# EAGLE design layer3 (EAGLE 9.6.2)

## Sheet 1 of 5
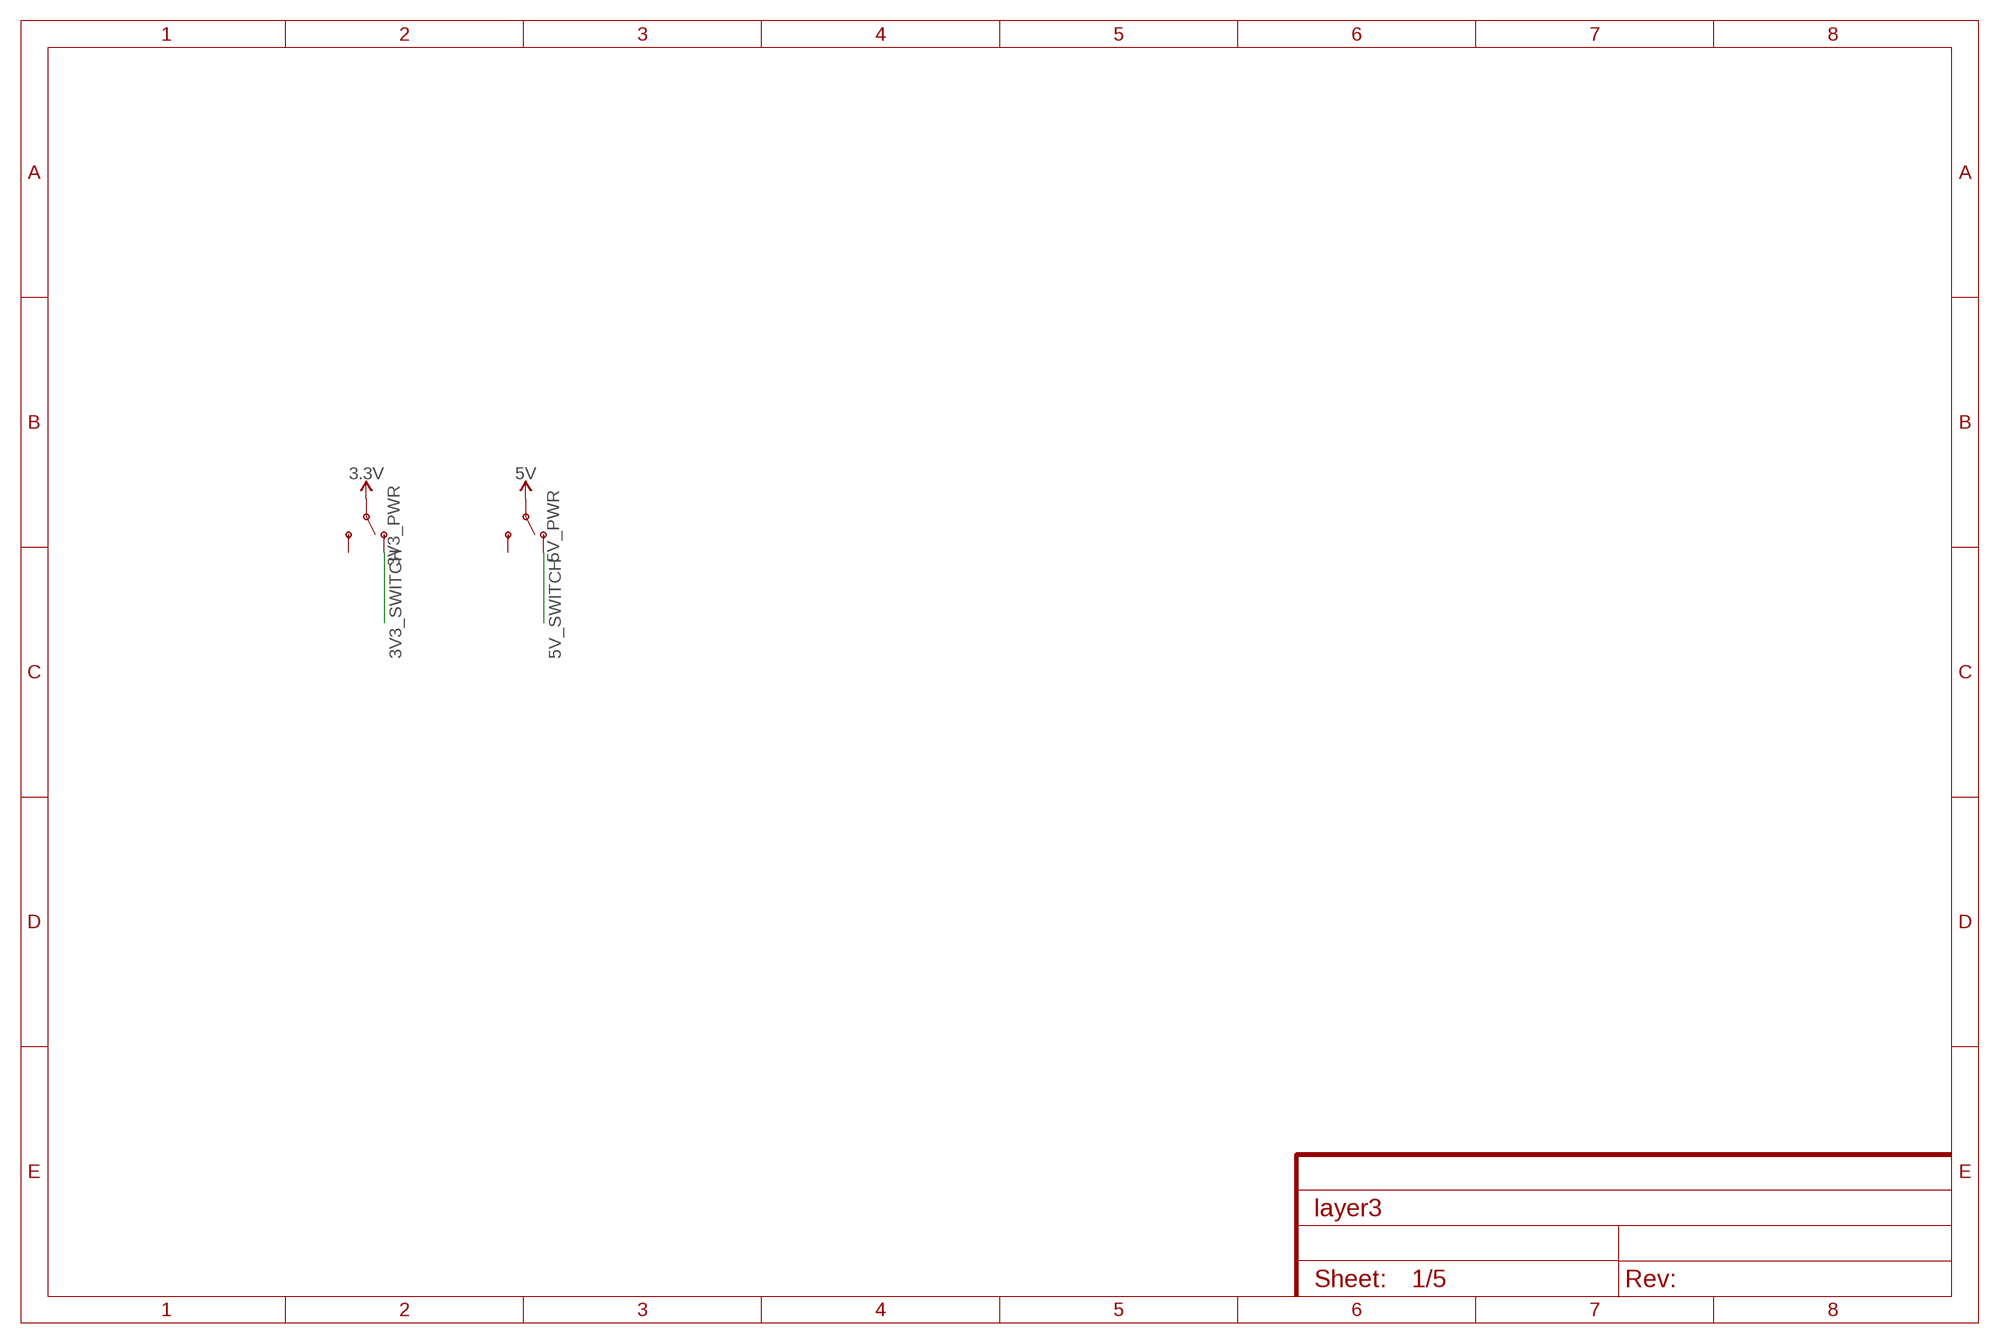
[diagram p0: schematic, sheet 1]

### Parts
3V3_PWR  SWITCH-SPDT-PTH-11.6X4.0MM-LOCK  [SWITCH_SPDT_PTH_11.6X4.0MM_LOCK]
5V_PWR  SWITCH-SPDT-PTH-11.6X4.0MM-LOCK  [SWITCH_SPDT_PTH_11.6X4.0MM_LOCK]

### Nets
3.3V: 3V3_PWR.2(P) ; also sheet 4,5
3V3_SWITCH: 3V3_PWR.1(O) ; also sheet 2,3,4
5V: 5V_PWR.2(P) ; also sheet 5
5V_SWITCH: 5V_PWR.1(O) ; also sheet 4
Unconnected: 3V3_PWR.3(S) 5V_PWR.3(S)

## Sheet 2 of 5: STEM32
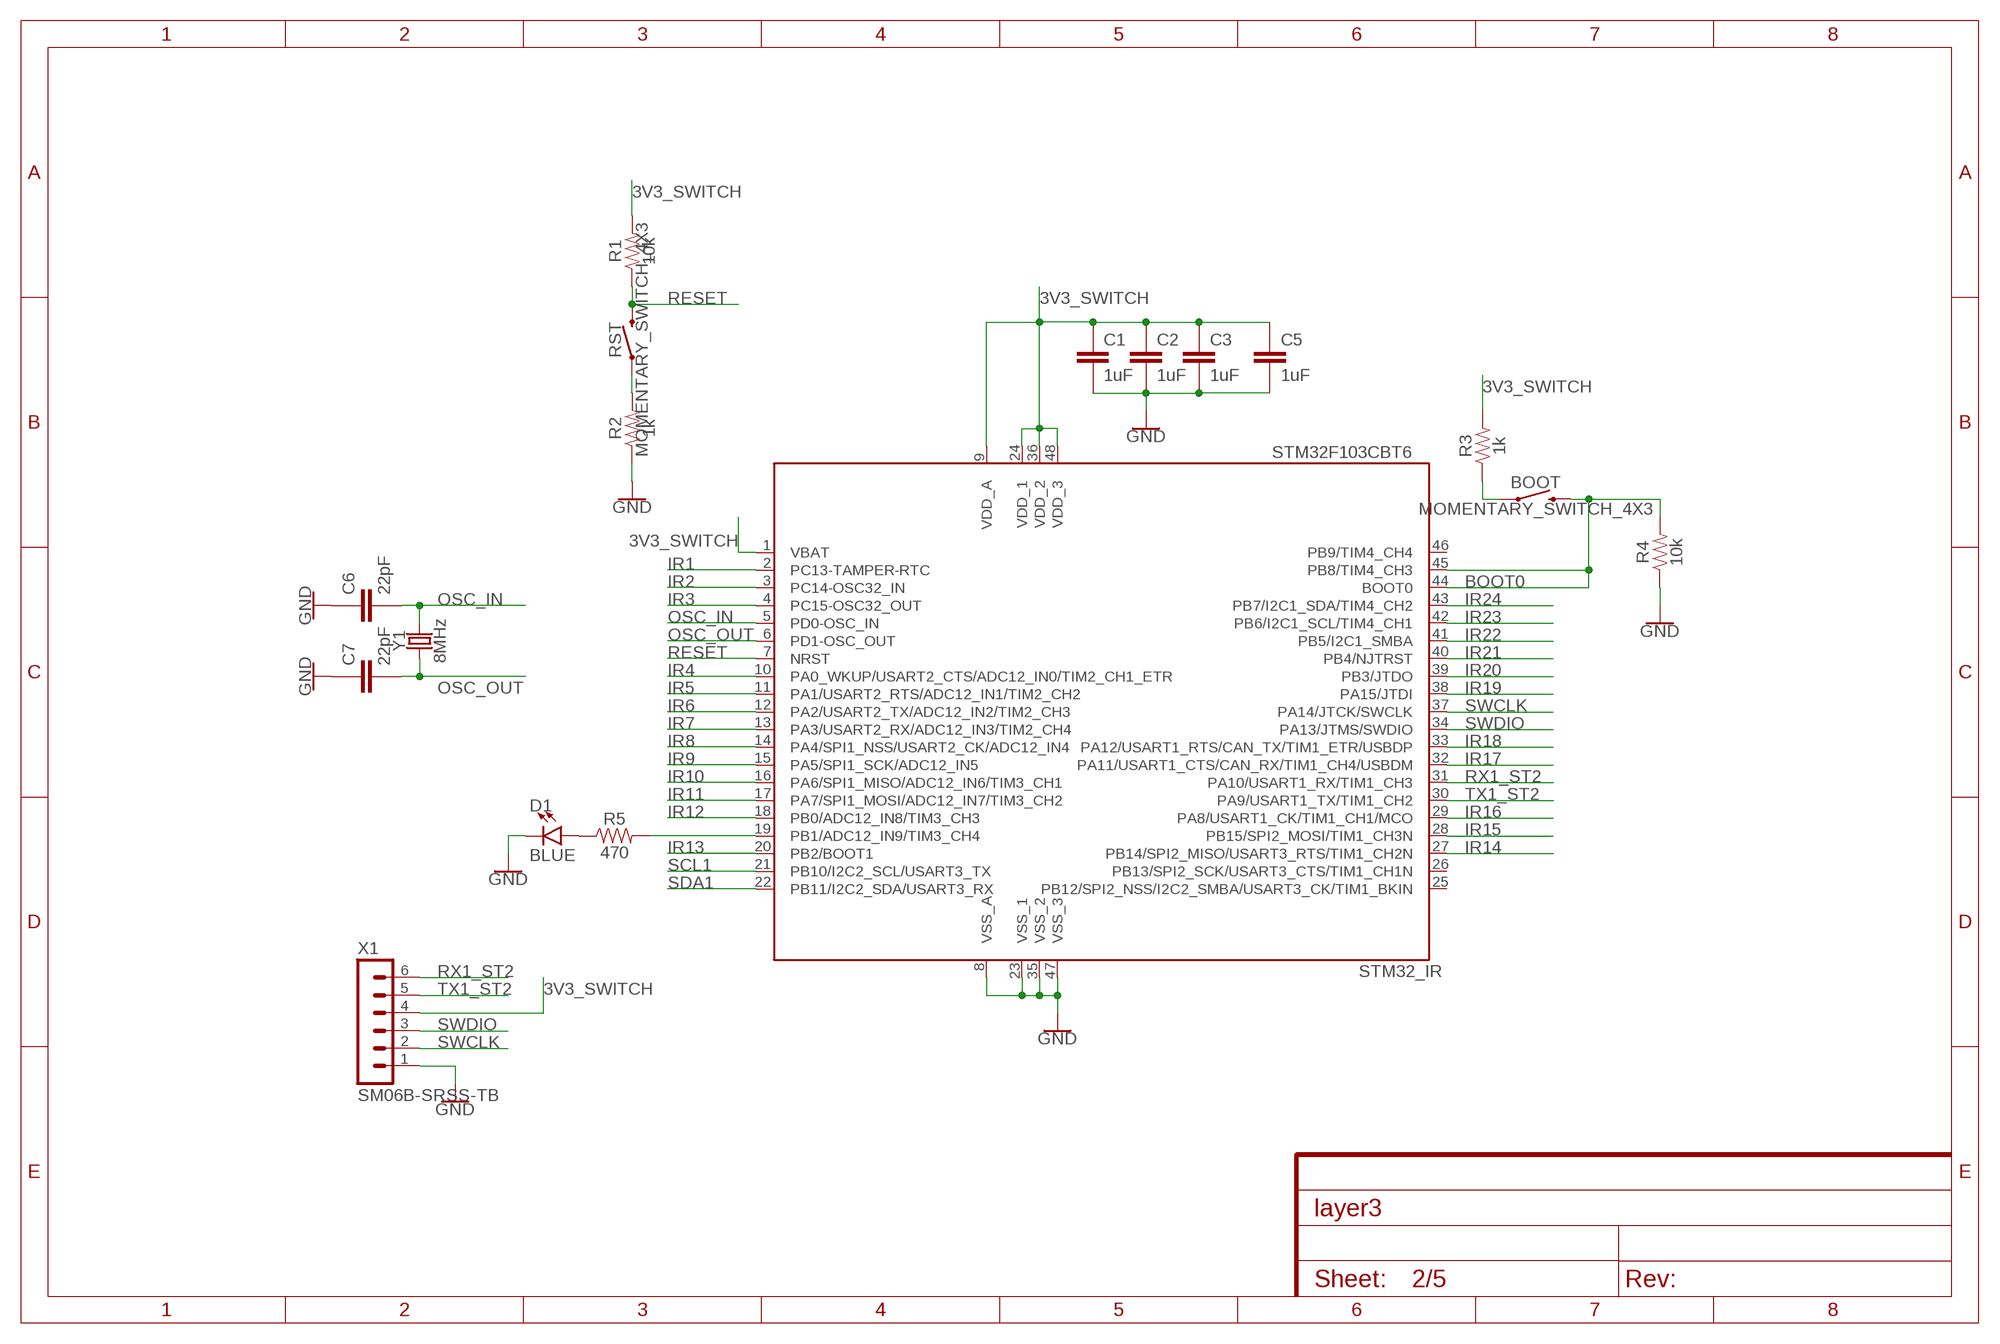
[diagram p1: schematic, sheet 2]

### Parts
BOOT  MOMENTARY_SWITCH_4X3  [MOMENTARY_SWITCH_4X3]
C1  1uF  CAPACITOR0603  [C0603]
C2  1uF  CAPACITOR0603  [C0603]
C3  1uF  CAPACITOR0603  [C0603]
C5  1uF  CAPACITOR0603  [C0603]
C6  22pF  CAPACITOR0603  [C0603]
C7  22pF  CAPACITOR0603  [C0603]
D1  BLUE  LED0603  [LED-0603]
R1  10k  RESISTOR0603  [R0603]
R2  1k  RESISTOR0603  [R0603]
R3  1k  RESISTOR0603  [R0603]
R4  10k  RESISTOR0603  [R0603]
R5  470  RESISTOR0603  [R0603]
RST  MOMENTARY_SWITCH_4X3  [MOMENTARY_SWITCH_4X3]
STM32_IR  STM32F103CBT6  [LQFP48]
X1  SM06B-SRSS-TB  [SM06B-SRSS-TB]
Y1  8MHz  CRYSTALSMD-5X3.2-2PAD  [CRYSTAL-SMD-5X3.2-2PAD]

### Nets
3V3_SWITCH: C1.1 C2.1 C3.1 C5.2 R1.2 R3.2 STM32_IR.1(VBAT) STM32_IR.9(VDD_A) STM32_IR.24(VDD_1) STM32_IR.36(VDD_2) STM32_IR.48(VDD_3) X1.4 ; also sheet 1,3,4
BOOT0: BOOT.P$2 R4.2 STM32_IR.44(BOOT0) STM32_IR.45(PB8/TIM4_CH3)
GND: C1.2 C2.2 C3.2 C5.1 C6.1 C7.1 D1.C R2.1 R4.1 STM32_IR.8(VSS_A) STM32_IR.23(VSS_1) STM32_IR.35(VSS_2) STM32_IR.47(VSS_3) X1.1 ; also sheet 3,4,5
IR1: STM32_IR.2(PC13-TAMPER-RTC) ; also sheet 3
IR2: STM32_IR.3(PC14-OSC32_IN) ; also sheet 3
IR3: STM32_IR.4(PC15-OSC32_OUT) ; also sheet 3
IR4: STM32_IR.10(PA0_WKUP/USART2_CTS/ADC12_IN0/TIM2_CH1_ETR) ; also sheet 3
IR5: STM32_IR.11(PA1/USART2_RTS/ADC12_IN1/TIM2_CH2) ; also sheet 3
IR6: STM32_IR.12(PA2/USART2_TX/ADC12_IN2/TIM2_CH3) ; also sheet 3
IR7: STM32_IR.13(PA3/USART2_RX/ADC12_IN3/TIM2_CH4) ; also sheet 3
IR8: STM32_IR.14(PA4/SPI1_NSS/USART2_CK/ADC12_IN4) ; also sheet 3
IR9: STM32_IR.15(PA5/SPI1_SCK/ADC12_IN5) ; also sheet 3
IR10: STM32_IR.16(PA6/SPI1_MISO/ADC12_IN6/TIM3_CH1) ; also sheet 3
IR11: STM32_IR.17(PA7/SPI1_MOSI/ADC12_IN7/TIM3_CH2) ; also sheet 3
IR12: STM32_IR.18(PB0/ADC12_IN8/TIM3_CH3) ; also sheet 3
IR13: STM32_IR.20(PB2/BOOT1) ; also sheet 3
IR14: STM32_IR.27(PB14/SPI2_MISO/USART3_RTS/TIM1_CH2N) ; also sheet 3
IR15: STM32_IR.28(PB15/SPI2_MOSI/TIM1_CH3N) ; also sheet 3
IR16: STM32_IR.29(PA8/USART1_CK/TIM1_CH1/MCO) ; also sheet 3
IR17: STM32_IR.32(PA11/USART1_CTS/CAN_RX/TIM1_CH4/USBDM) ; also sheet 3
IR18: STM32_IR.33(PA12/USART1_RTS/CAN_TX/TIM1_ETR/USBDP) ; also sheet 3
IR19: STM32_IR.38(PA15/JTDI) ; also sheet 3
IR20: STM32_IR.39(PB3/JTDO) ; also sheet 3
IR21: STM32_IR.40(PB4/NJTRST) ; also sheet 3
IR22: STM32_IR.41(PB5/I2C1_SMBA) ; also sheet 3
IR23: STM32_IR.42(PB6/I2C1_SCL/TIM4_CH1) ; also sheet 3
IR24: STM32_IR.43(PB7/I2C1_SDA/TIM4_CH2) ; also sheet 3
N$70: R2.2 RST.P$1
N$72: BOOT.P$1 R3.1
N$73: R5.2 STM32_IR.19(PB1/ADC12_IN9/TIM3_CH4)
N$74: D1.A R5.1
OSC_IN: C6.2 STM32_IR.5(PD0-OSC_IN) Y1.P$2
OSC_OUT: C7.2 STM32_IR.6(PD1-OSC_OUT) Y1.P$1
RESET: R1.1 RST.P$2 STM32_IR.7(NRST)
RX1_ST2: STM32_IR.31(PA10/USART1_RX/TIM1_CH3) X1.6 ; also sheet 4
SCL1: STM32_IR.21(PB10/I2C2_SCL/USART3_TX)
SDA1: STM32_IR.22(PB11/I2C2_SDA/USART3_RX)
SWCLK: STM32_IR.37(PA14/JTCK/SWCLK) X1.2
SWDIO: STM32_IR.34(PA13/JTMS/SWDIO) X1.3
TX1_ST2: STM32_IR.30(PA9/USART1_TX/TIM1_CH2) X1.5 ; also sheet 4
Unconnected: STM32_IR.25(PB12/SPI2_NSS/I2C2_SMBA/USART3_CK/TIM1_BKIN) STM32_IR.26(PB13/SPI2_SCK/USART3_CTS/TIM1_CH1N) STM32_IR.46(PB9/TIM4_CH4)

## Sheet 3 of 5: IR Sensor
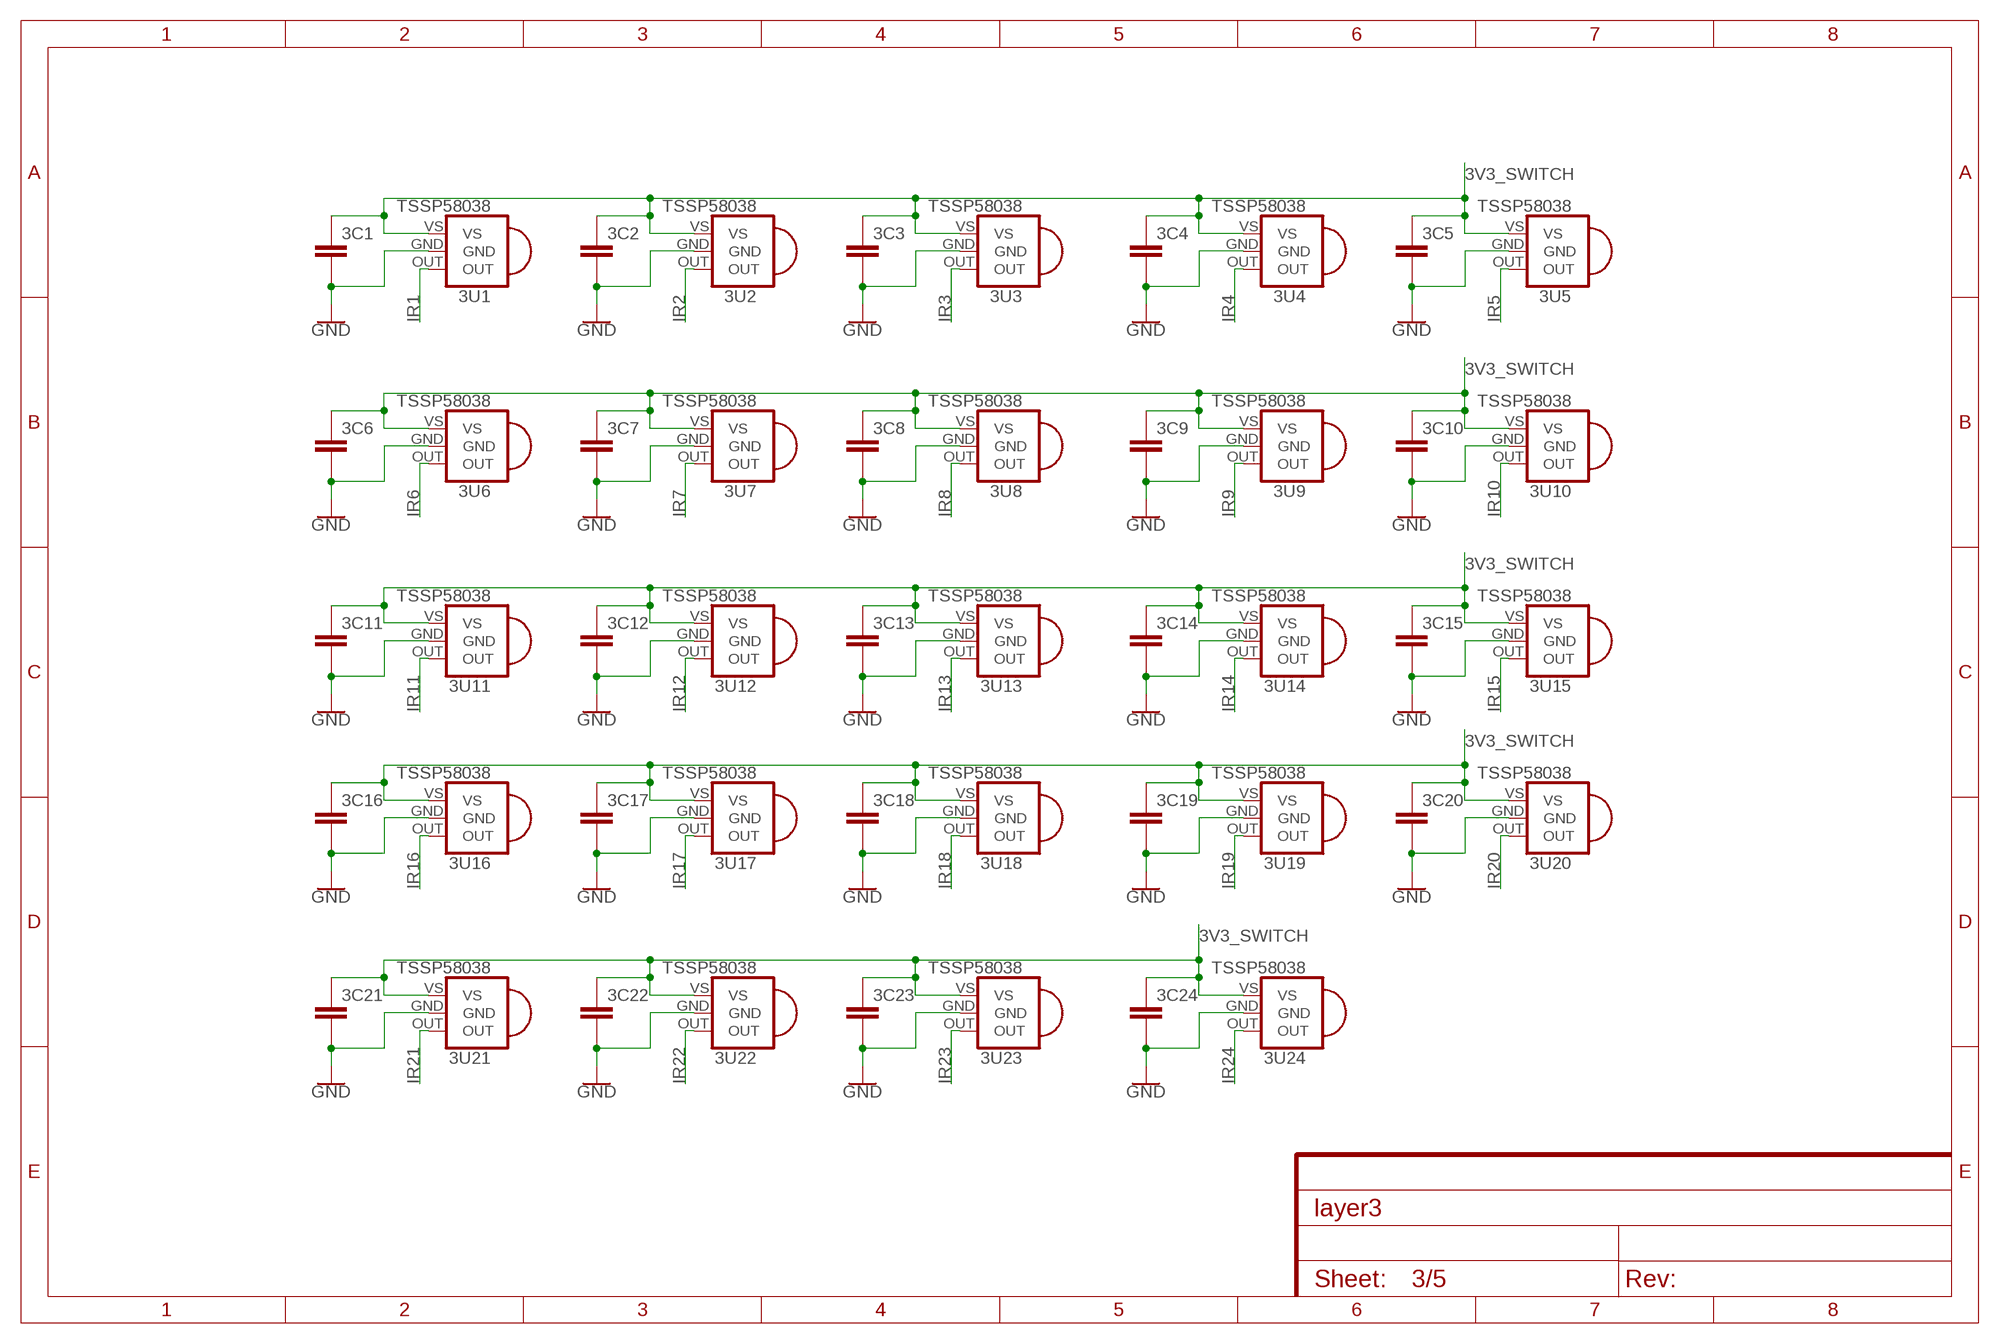
[diagram p2: schematic, sheet 3]

### Parts
3C1  CAPACITOR0603  [C0603]
3C2  CAPACITOR0603  [C0603]
3C3  CAPACITOR0603  [C0603]
3C4  CAPACITOR0603  [C0603]
3C5  CAPACITOR0603  [C0603]
3C6  CAPACITOR0603  [C0603]
3C7  CAPACITOR0603  [C0603]
3C8  CAPACITOR0603  [C0603]
3C9  CAPACITOR0603  [C0603]
3C10  CAPACITOR0603  [C0603]
3C11  CAPACITOR0603  [C0603]
3C12  CAPACITOR0603  [C0603]
3C13  CAPACITOR0603  [C0603]
3C14  CAPACITOR0603  [C0603]
3C15  CAPACITOR0603  [C0603]
3C16  CAPACITOR0603  [C0603]
3C17  CAPACITOR0603  [C0603]
3C18  CAPACITOR0603  [C0603]
3C19  CAPACITOR0603  [C0603]
3C20  CAPACITOR0603  [C0603]
3C21  CAPACITOR0603  [C0603]
3C22  CAPACITOR0603  [C0603]
3C23  CAPACITOR0603  [C0603]
3C24  CAPACITOR0603  [C0603]
3U1  TSSP58038  [TSSP58038]
3U2  TSSP58038  [TSSP58038]
3U3  TSSP58038  [TSSP58038]
3U4  TSSP58038  [TSSP58038]
3U5  TSSP58038  [TSSP58038]
3U6  TSSP58038  [TSSP58038]
3U7  TSSP58038  [TSSP58038]
3U8  TSSP58038  [TSSP58038]
3U9  TSSP58038  [TSSP58038]
3U10  TSSP58038  [TSSP58038]
3U11  TSSP58038  [TSSP58038]
3U12  TSSP58038  [TSSP58038]
3U13  TSSP58038  [TSSP58038]
3U14  TSSP58038  [TSSP58038]
3U15  TSSP58038  [TSSP58038]
3U16  TSSP58038  [TSSP58038]
3U17  TSSP58038  [TSSP58038]
3U18  TSSP58038  [TSSP58038]
3U19  TSSP58038  [TSSP58038]
3U20  TSSP58038  [TSSP58038]
3U21  TSSP58038  [TSSP58038]
3U22  TSSP58038  [TSSP58038]
3U23  TSSP58038  [TSSP58038]
3U24  TSSP58038  [TSSP58038]

### Nets
3V3_SWITCH: 3C1.1 3C2.1 3C3.1 3C4.1 3C5.1 3C6.1 3C7.1 3C8.1 3C9.1 3C10.1 3C11.1 3C12.1 3C13.1 3C14.1 3C15.1 3C16.1 3C17.1 3C18.1 3C19.1 3C20.1 3C21.1 3C22.1 3C23.1 3C24.1 3U1.VS 3U2.VS 3U3.VS 3U4.VS 3U5.VS 3U6.VS 3U7.VS 3U8.VS 3U9.VS 3U10.VS 3U11.VS 3U12.VS 3U13.VS 3U14.VS 3U15.VS 3U16.VS 3U17.VS 3U18.VS 3U19.VS 3U20.VS 3U21.VS 3U22.VS 3U23.VS 3U24.VS ; also sheet 1,2,4
GND: 3C1.2 3C2.2 3C3.2 3C4.2 3C5.2 3C6.2 3C7.2 3C8.2 3C9.2 3C10.2 3C11.2 3C12.2 3C13.2 3C14.2 3C15.2 3C16.2 3C17.2 3C18.2 3C19.2 3C20.2 3C21.2 3C22.2 3C23.2 3C24.2 3U1.GND 3U2.GND 3U3.GND 3U4.GND 3U5.GND 3U6.GND 3U7.GND 3U8.GND 3U9.GND 3U10.GND 3U11.GND 3U12.GND 3U13.GND 3U14.GND 3U15.GND 3U16.GND 3U17.GND 3U18.GND 3U19.GND 3U20.GND 3U21.GND 3U22.GND 3U23.GND 3U24.GND ; also sheet 2,4,5
IR1: 3U1.OUT ; also sheet 2
IR2: 3U2.OUT ; also sheet 2
IR3: 3U3.OUT ; also sheet 2
IR4: 3U4.OUT ; also sheet 2
IR5: 3U5.OUT ; also sheet 2
IR6: 3U6.OUT ; also sheet 2
IR7: 3U7.OUT ; also sheet 2
IR8: 3U8.OUT ; also sheet 2
IR9: 3U9.OUT ; also sheet 2
IR10: 3U10.OUT ; also sheet 2
IR11: 3U11.OUT ; also sheet 2
IR12: 3U12.OUT ; also sheet 2
IR13: 3U13.OUT ; also sheet 2
IR14: 3U14.OUT ; also sheet 2
IR15: 3U15.OUT ; also sheet 2
IR16: 3U16.OUT ; also sheet 2
IR17: 3U17.OUT ; also sheet 2
IR18: 3U18.OUT ; also sheet 2
IR19: 3U19.OUT ; also sheet 2
IR20: 3U20.OUT ; also sheet 2
IR21: 3U21.OUT ; also sheet 2
IR22: 3U22.OUT ; also sheet 2
IR23: 3U23.OUT ; also sheet 2
IR24: 3U24.OUT ; also sheet 2

## Sheet 4 of 5
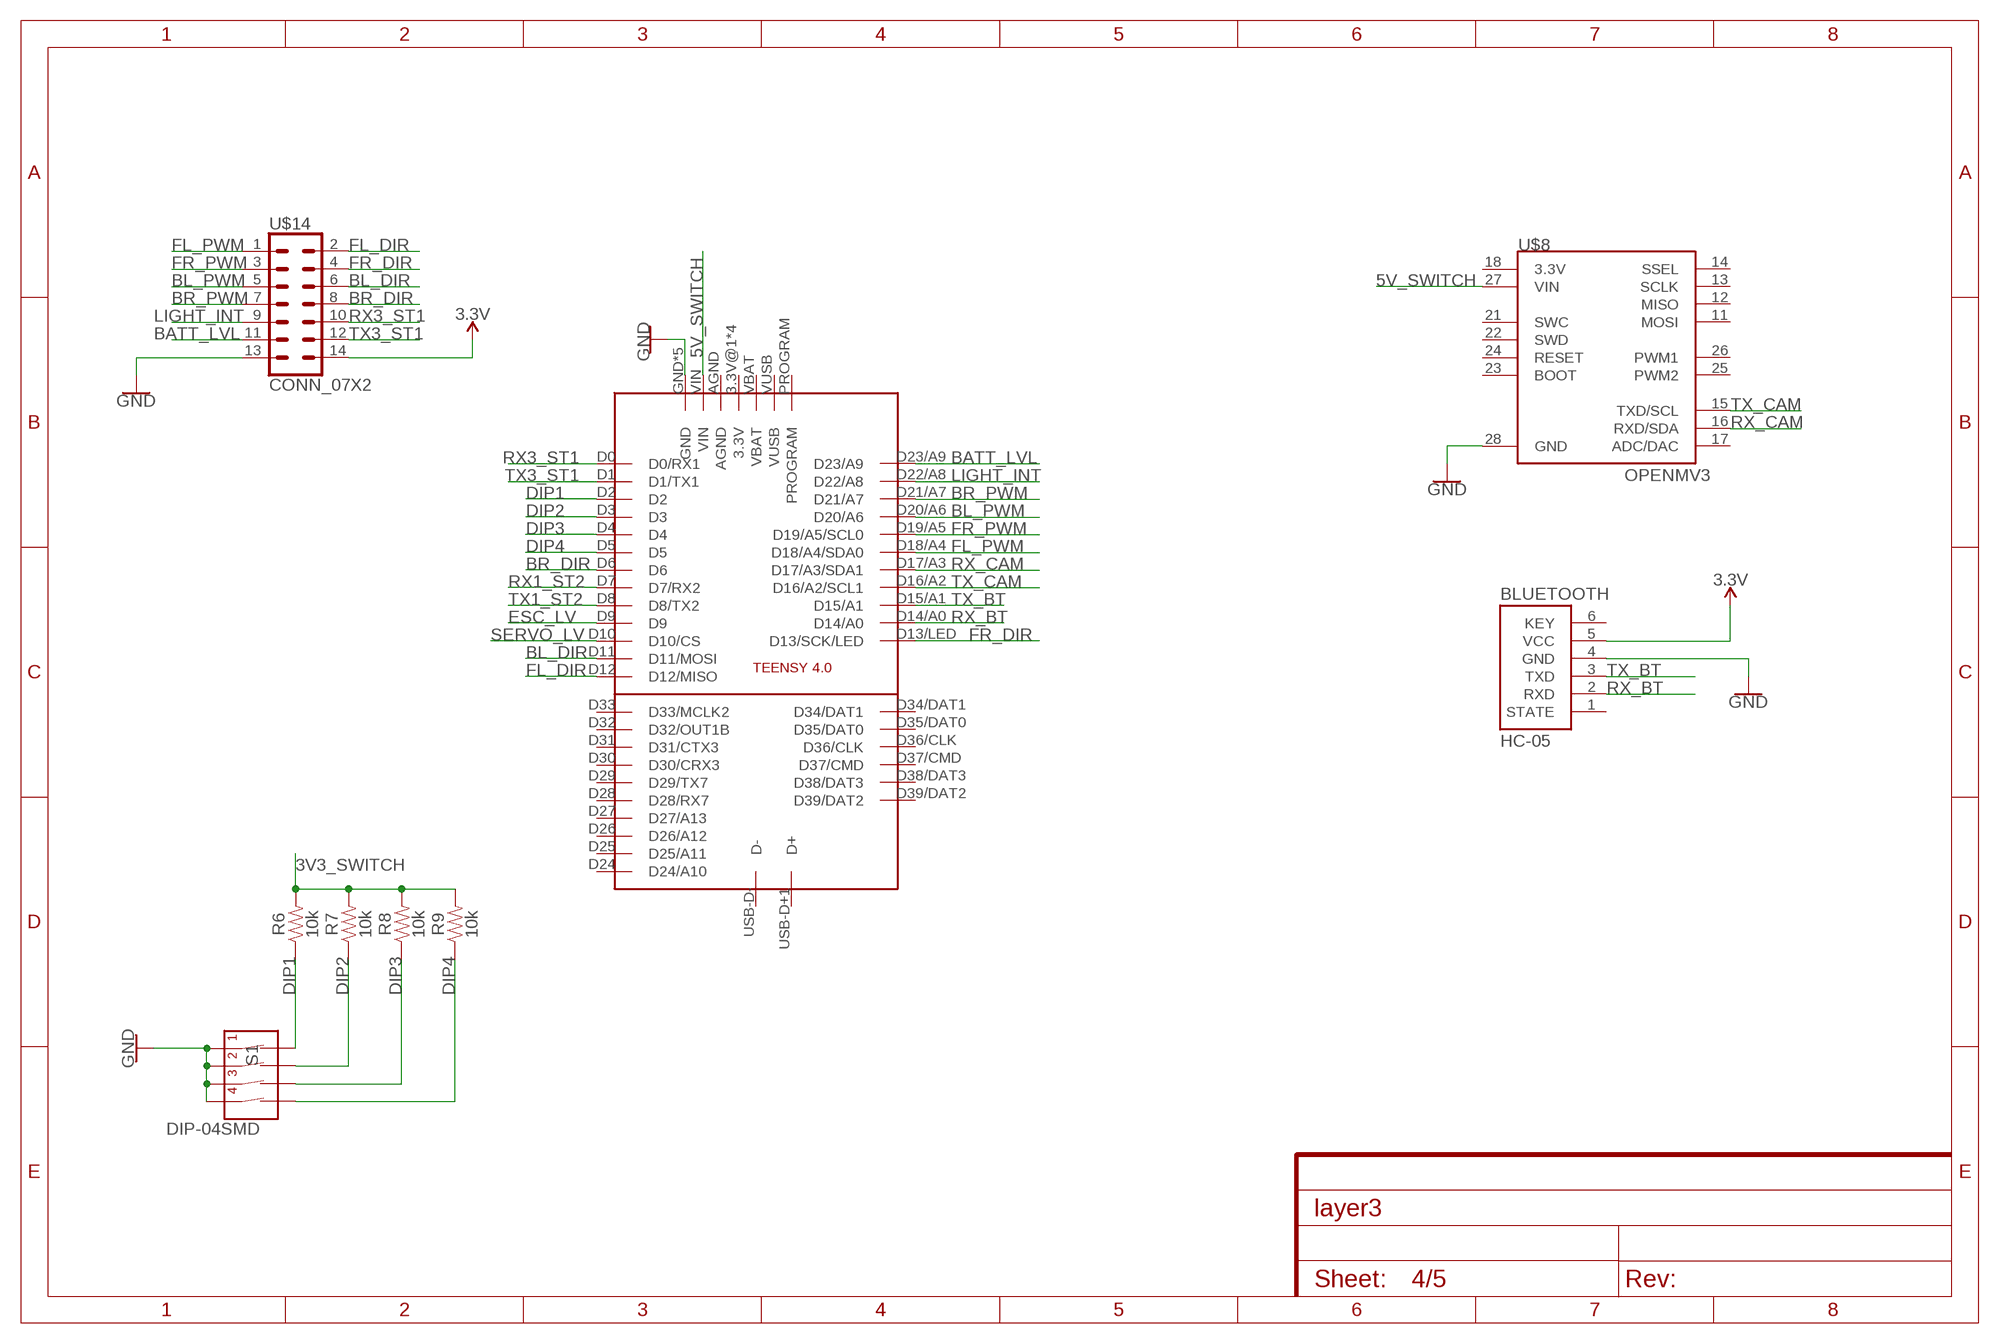
[diagram p3: schematic, sheet 4]

### Parts
BLUETOOTH  HC-05  [HC-05]
R6  10k  RESISTOR0603  [R0603]
R7  10k  RESISTOR0603  [R0603]
R8  10k  RESISTOR0603  [R0603]
R9  10k  RESISTOR0603  [R0603]
S1  DIP-04SMD  [DIPSWITCH-04-SMD]
TEENSY4  TEENSY-4.0-FULL-BREAKOUT-PINS  [TEENSY-4.0-FULL-BREAKOUT-PINS]
U$8  OPENMV3  [OPENMV3]
U$14  CONN_07X2  [2X7]

### Nets
3.3V: BLUETOOTH.5(VCC) U$14.14 ; also sheet 1,5
3V3_SWITCH: R6.2 R7.2 R8.2 R9.2 ; also sheet 1,2,3
5V_SWITCH: TEENSY4.VIN U$8.27(VIN) ; also sheet 1
BATT_LVL: TEENSY4.D23/A9 U$14.11
BL_DIR: TEENSY4.D11(D11/MOSI) U$14.6
BL_PWM: TEENSY4.D20/A6 U$14.5
BR_DIR: TEENSY4.D6 U$14.8
BR_PWM: TEENSY4.D21/A7 U$14.7
DIP1: R6.1 S1.1(1A) TEENSY4.D2
DIP2: R7.1 S1.2(2A) TEENSY4.D3
DIP3: R8.1 S1.3(3A) TEENSY4.D4
DIP4: R9.1 S1.4(4A) TEENSY4.D5
ESC_LV: TEENSY4.D9 ; also sheet 5
FL_DIR: TEENSY4.D12(D12/MISO) U$14.2
FL_PWM: TEENSY4.D18/A4(D18/A4/SDA0) U$14.1
FR_DIR: TEENSY4.D13/LED(D13/SCK/LED) U$14.4
FR_PWM: TEENSY4.D19/A5(D19/A5/SCL0) U$14.3
GND: BLUETOOTH.4(GND) S1.5(4B) S1.6(3B) S1.7(2B) S1.8(1B) TEENSY4.GND TEENSY4.GND@1(GND) TEENSY4.GND@2(GND) TEENSY4.P$11(GND) TEENSY4.P$12(GND) U$8.28(GND) U$14.13 ; also sheet 2,3,5
LIGHT_INT: TEENSY4.D22/A8 U$14.9
RX1_ST2: TEENSY4.D7(D7/RX2) ; also sheet 2
RX3_ST1: TEENSY4.D0(D0/RX1) U$14.10
RX_BT: BLUETOOTH.2(RXD) TEENSY4.D14/A0
RX_CAM: TEENSY4.D17/A3(D17/A3/SDA1) U$8.16(RXD/SDA)
SERVO_LV: TEENSY4.D10(D10/CS) ; also sheet 5
TX1_ST2: TEENSY4.D8(D8/TX2) ; also sheet 2
TX3_ST1: TEENSY4.D1(D1/TX1) U$14.12
TX_BT: BLUETOOTH.3(TXD) TEENSY4.D15/A1
TX_CAM: TEENSY4.D16/A2(D16/A2/SCL1) U$8.15(TXD/SCL)
Unconnected: BLUETOOTH.1(STATE) BLUETOOTH.6(KEY) TEENSY4.3.3V@1(3.3V) TEENSY4.3.3V@2(3.3V) TEENSY4.3V3(3.3V) TEENSY4.AGND TEENSY4.D24(D24/A10) TEENSY4.D25(D25/A11) TEENSY4.D26(D26/A12) TEENSY4.D27(D27/A13) TEENSY4.D28(D28/RX7) TEENSY4.D29(D29/TX7) TEENSY4.D30(D30/CRX3) TEENSY4.D31(D31/CTX3) TEENSY4.D32(D32/OUT1B) TEENSY4.D33(D33/MCLK2) TEENSY4.D34/DAT1 TEENSY4.D35/DAT0 TEENSY4.D36/CLK TEENSY4.D37/CMD TEENSY4.D38/DAT3 TEENSY4.D39/DAT2 TEENSY4.ON/OFF(3.3V) TEENSY4.PROGRAM TEENSY4.USB-D+1(D+) TEENSY4.USB-D-(D-) TEENSY4.VBAT TEENSY4.VUSB U$8.11(MOSI) U$8.12(MISO) U$8.13(SCLK) U$8.14(SSEL) U$8.17(ADC/DAC) U$8.18(3.3V) U$8.21(SWC) U$8.22(SWD) U$8.23(BOOT) U$8.24(RESET) U$8.25(PWM2) U$8.26(PWM1)

## Sheet 5 of 5: ESC + Servo
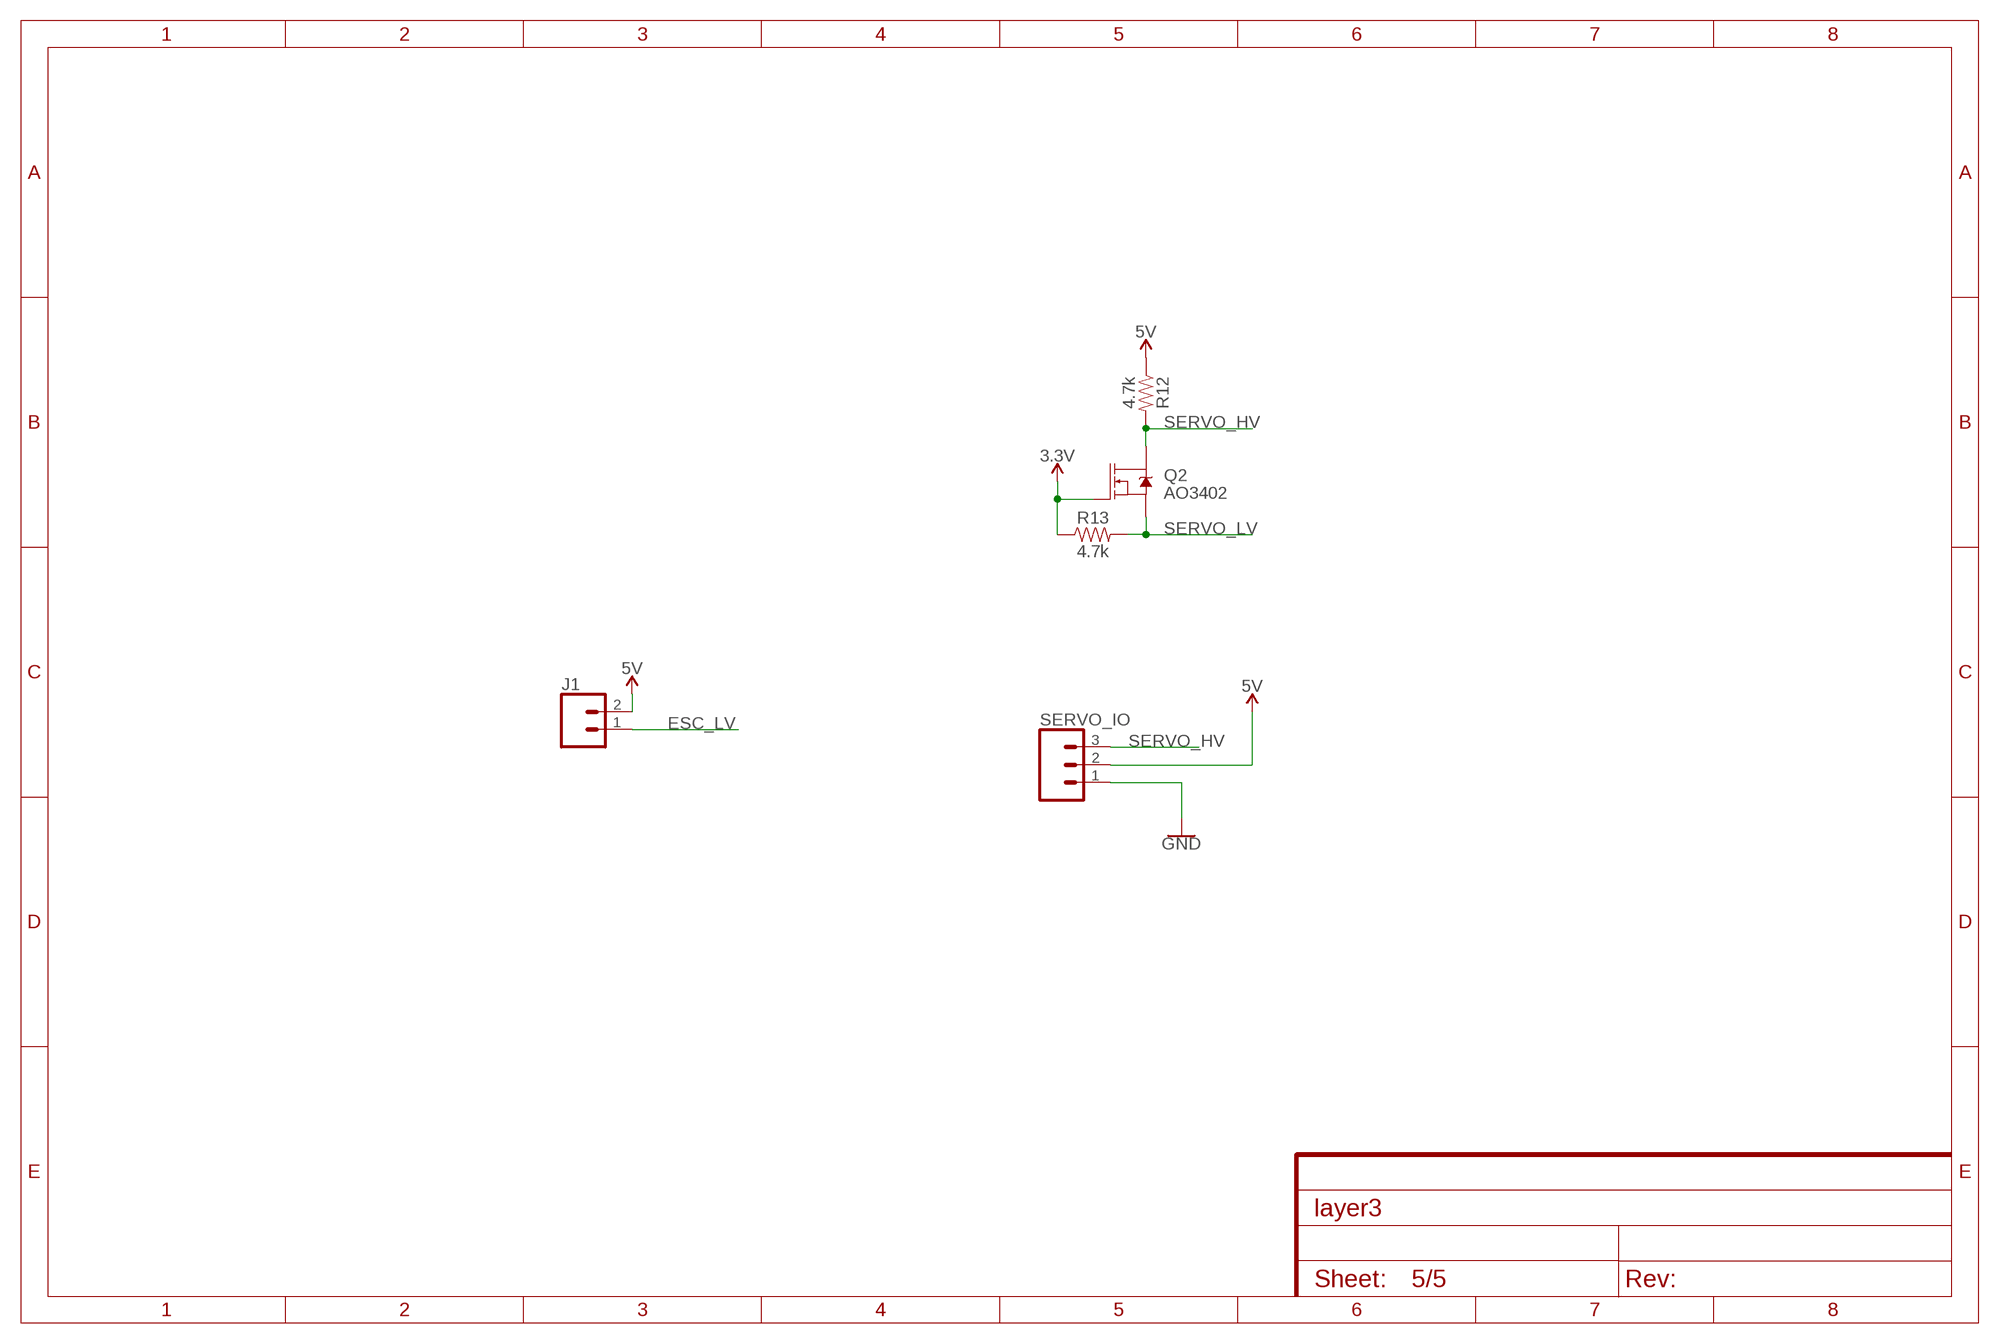
[diagram p4: schematic, sheet 5]

### Parts
J1  CONN_02LOCK  [1X02_LOCK]
Q2  AO3402  MOSFET-NCH-AO3404A  [SOT23-3]
R12  4.7k  RESISTOR0603  [R0603]
R13  4.7k  RESISTOR0603  [R0603]
SERVO_IO  CONN_03LOCK  [1X03_LOCK]

### Nets
3.3V: Q2.1(G) R13.1 ; also sheet 1,4
5V: J1.2 R12.1 SERVO_IO.2 ; also sheet 1
ESC_LV: J1.1 ; also sheet 4
GND: SERVO_IO.1 ; also sheet 2,3,4
SERVO_HV: Q2.3(D) R12.2 SERVO_IO.3
SERVO_LV: Q2.2(S) R13.2 ; also sheet 4

## Library data of the parts
3C1-3C24 C1-C3 C5-C7 = JH:CAPACITOR
3U1-3U24 = JH:TSSP58038
3V3_PWR 5V_PWR = SparkFun-Switches:SWITCH-SPDT: Single Pole, Double Throw (SPDT) Switch Single-pole, double-throw (SPDT) switch. Variant Overview SMD-AYZ0202 Surface Mount DPDT Switch <https://www.sparkfun.com/products/597> (COM-00597) Used on e.g. LilyPad Arduino USB - ATmega32U4 Board <https://www.sparkfun.com/products/12049> PTH-11.6X4.0MM SPDT Mini Power Switch <https://www.sparkfun.com/products/102> (COM-00102) Used on e.g. SparkFun Simon Says - Through-Hole Soldering Kit <https://www.sparkfun.com/products/10547> (KIT-10547) PTH-11.6X4.0MM-KIT KIT version of SPDT Mini Power Switch - Simplifies soldering by removing tStop of switch pins - only one side can be soldered. PTH-11.6X4.0MM-LOCK LOCK version of SPDT Mini Power Switch - Offset pins hold switch in place for easier soldering. SMD-RIGHT-ANGLE Surface Mount Right Angle Switch <https://www.sparkfun.com/products/10860> (COM-10860) Used on e.g. SparkFun ESP8266 Thing <https://www.sparkfun.com/products/13231>; PROD_ID: SWCH-08261; SF_SKU: COM-00102
BLUETOOTH = JH:HC-05
BOOT RST = MY-LIBRARY:MOMENTARY_SWITCH_4X3
D1 = SparkFun-LED:LED: LED (Generic) Standard schematic elements and footprints for 5mm, 3mm, 1206, and 0603 sized LEDs. Generic LEDs with no color specified.
J1 = Connectors:CONN_02: Multi connection point. Often used as Generic Header-pin footprint for 0.1 inch spaced/style header connections On any of the 0.1 inch spaced packages, you can populate with these: Break Away Headers - Straight <https://www.sparkfun.com/products/116> (PRT-00116) Break Away Male Headers - Right Angle <https://www.sparkfun.com/products/553> (PRT-00553) Female Headers <https://www.sparkfun.com/products/115> (PRT-00115) Break Away Headers - Machine Pin <https://www.sparkfun.com/products/117> (PRT-00117) Break Away Female Headers - Swiss Machine Pin <https://www.sparkfun.com/products/743> (PRT-00743) For SCREWTERMINALS and SPRING TERMINALS visit here: Screw Terimnals on SparkFun.com <https://www.sparkfun.com/search/results?term=Screw+Terminals> (5mm/3.5mm/2.54mm spacing) This device is also useful as a general connection point to wire up your design to another part of your project. Our various solder wires solder well into these plated through hole pads. Hook-Up Wire - Assortment (Stranded, 22 AWG) <https://www.sparkfun.com/products/11375> (PRT-11375) Hook-Up Wire - Assortment (Solid Core, 22 AWG) <https://www.sparkfun.com/products/11367> (PRT-11367) View the entire wire category on our website here <https://www.sparkfun.com/categories/141> Special notes: Molex polarized connector foot print use with: PRT-08233 with associated crimp pins and housings. 2.54_SCREWTERM for use with PRT-10571. 3.5mm Screw Terminal footprints for PRT-08084 5mm Screw Terminal footprints for use with PRT-08432
Q2 = SparkFun-DiscreteSemi:MOSFET-NCH: N-channel MOSFETs Voltage controlled devices that allow control of high current outputs. SparkFun Products: SparkFun OpenScale <https://www.sparkfun.com/products/13261> SparkFun Digital Sandbox <https://www.sparkfun.com/products/12651> SparkFun Monster Moto Shield <https://www.sparkfun.com/products/10182> SparkFun MOSFET Power Controller <https://www.sparkfun.com/products/11214>; PROD_ID: TRANS-12988; VALUE: 5.8A/30V/35mΩ
R1-R9 R12 R13 = JH:RESISTOR
S1 = SparkFun-Switches:DIP-04: 4-Position DIP Switch 4-circuit DIP (dual inline package) switch. Commonly used to physcially set a circuit's behavior. SparkFun Products Prototype Part
SERVO_IO = SparkFun-Connectors:CONN_03: Multi connection point. Often used as Generic Header-pin footprint for 0.1 inch spaced/style header connections On any of the 0.1 inch spaced packages, you can populate with these: Break Away Headers - Straight <https://www.sparkfun.com/products/116> (PRT-00116) Break Away Male Headers - Right Angle <https://www.sparkfun.com/products/553> (PRT-00553) Female Headers <https://www.sparkfun.com/products/115> (PRT-00115) Break Away Headers - Machine Pin <https://www.sparkfun.com/products/117> (PRT-00117) Break Away Female Headers - Swiss Machine Pin <https://www.sparkfun.com/products/743> (PRT-00743) Stackable Header - 3 Pin (Female, 0.1") <https://www.sparkfun.com/products/13875> (PRT-13875) For SCREWTERMINALS and SPRING TERMINALS visit here: Screw Terimnals on SparkFun.com <https://www.sparkfun.com/search/results?term=Screw+Terminals> (5mm/3.5mm/2.54mm spacing) This device is also useful as a general connection point to wire up your design to another part of your project. Our various solder wires solder well into these plated through hole pads. Hook-Up Wire - Assortment (Stranded, 22 AWG) <https://www.sparkfun.com/products/11375> (PRT-11375) Hook-Up Wire - Assortment (Solid Core, 22 AWG) <https://www.sparkfun.com/products/11367> (PRT-11367) View the entire wire category on our website here <https://www.sparkfun.com/categories/141> Special notes: Molex polarized connector foot print use with SKU : PRT-08232 with associated crimp pins and housings.
STM32_IR = JH:STM32F103CBT6
TEENSY4 = Teensy-4.0:TEENSY-4.0-FULL-BREAKOUT-PINS
U$8 = openmv:OPENMV3
U$14 = MY-LIBRARY:CONN_07X2
X1 = con-JST SH:SM06B-SRSS: JST SH series header 1.00mm pitch disconnectable crimp style connectors, horizontal (side entry type), 6 pins
Y1 = SparkFun-Clocks:CRYSTAL: Crystals (Generic) These are passive quartz crystals, which can be used as a clock source for a microcontroller. Crystal's are two-terminal devices. They require external "load" capacitors to generate an oscillating signal.

## Net classes
0 default: clearance 0.205 mm

## Board
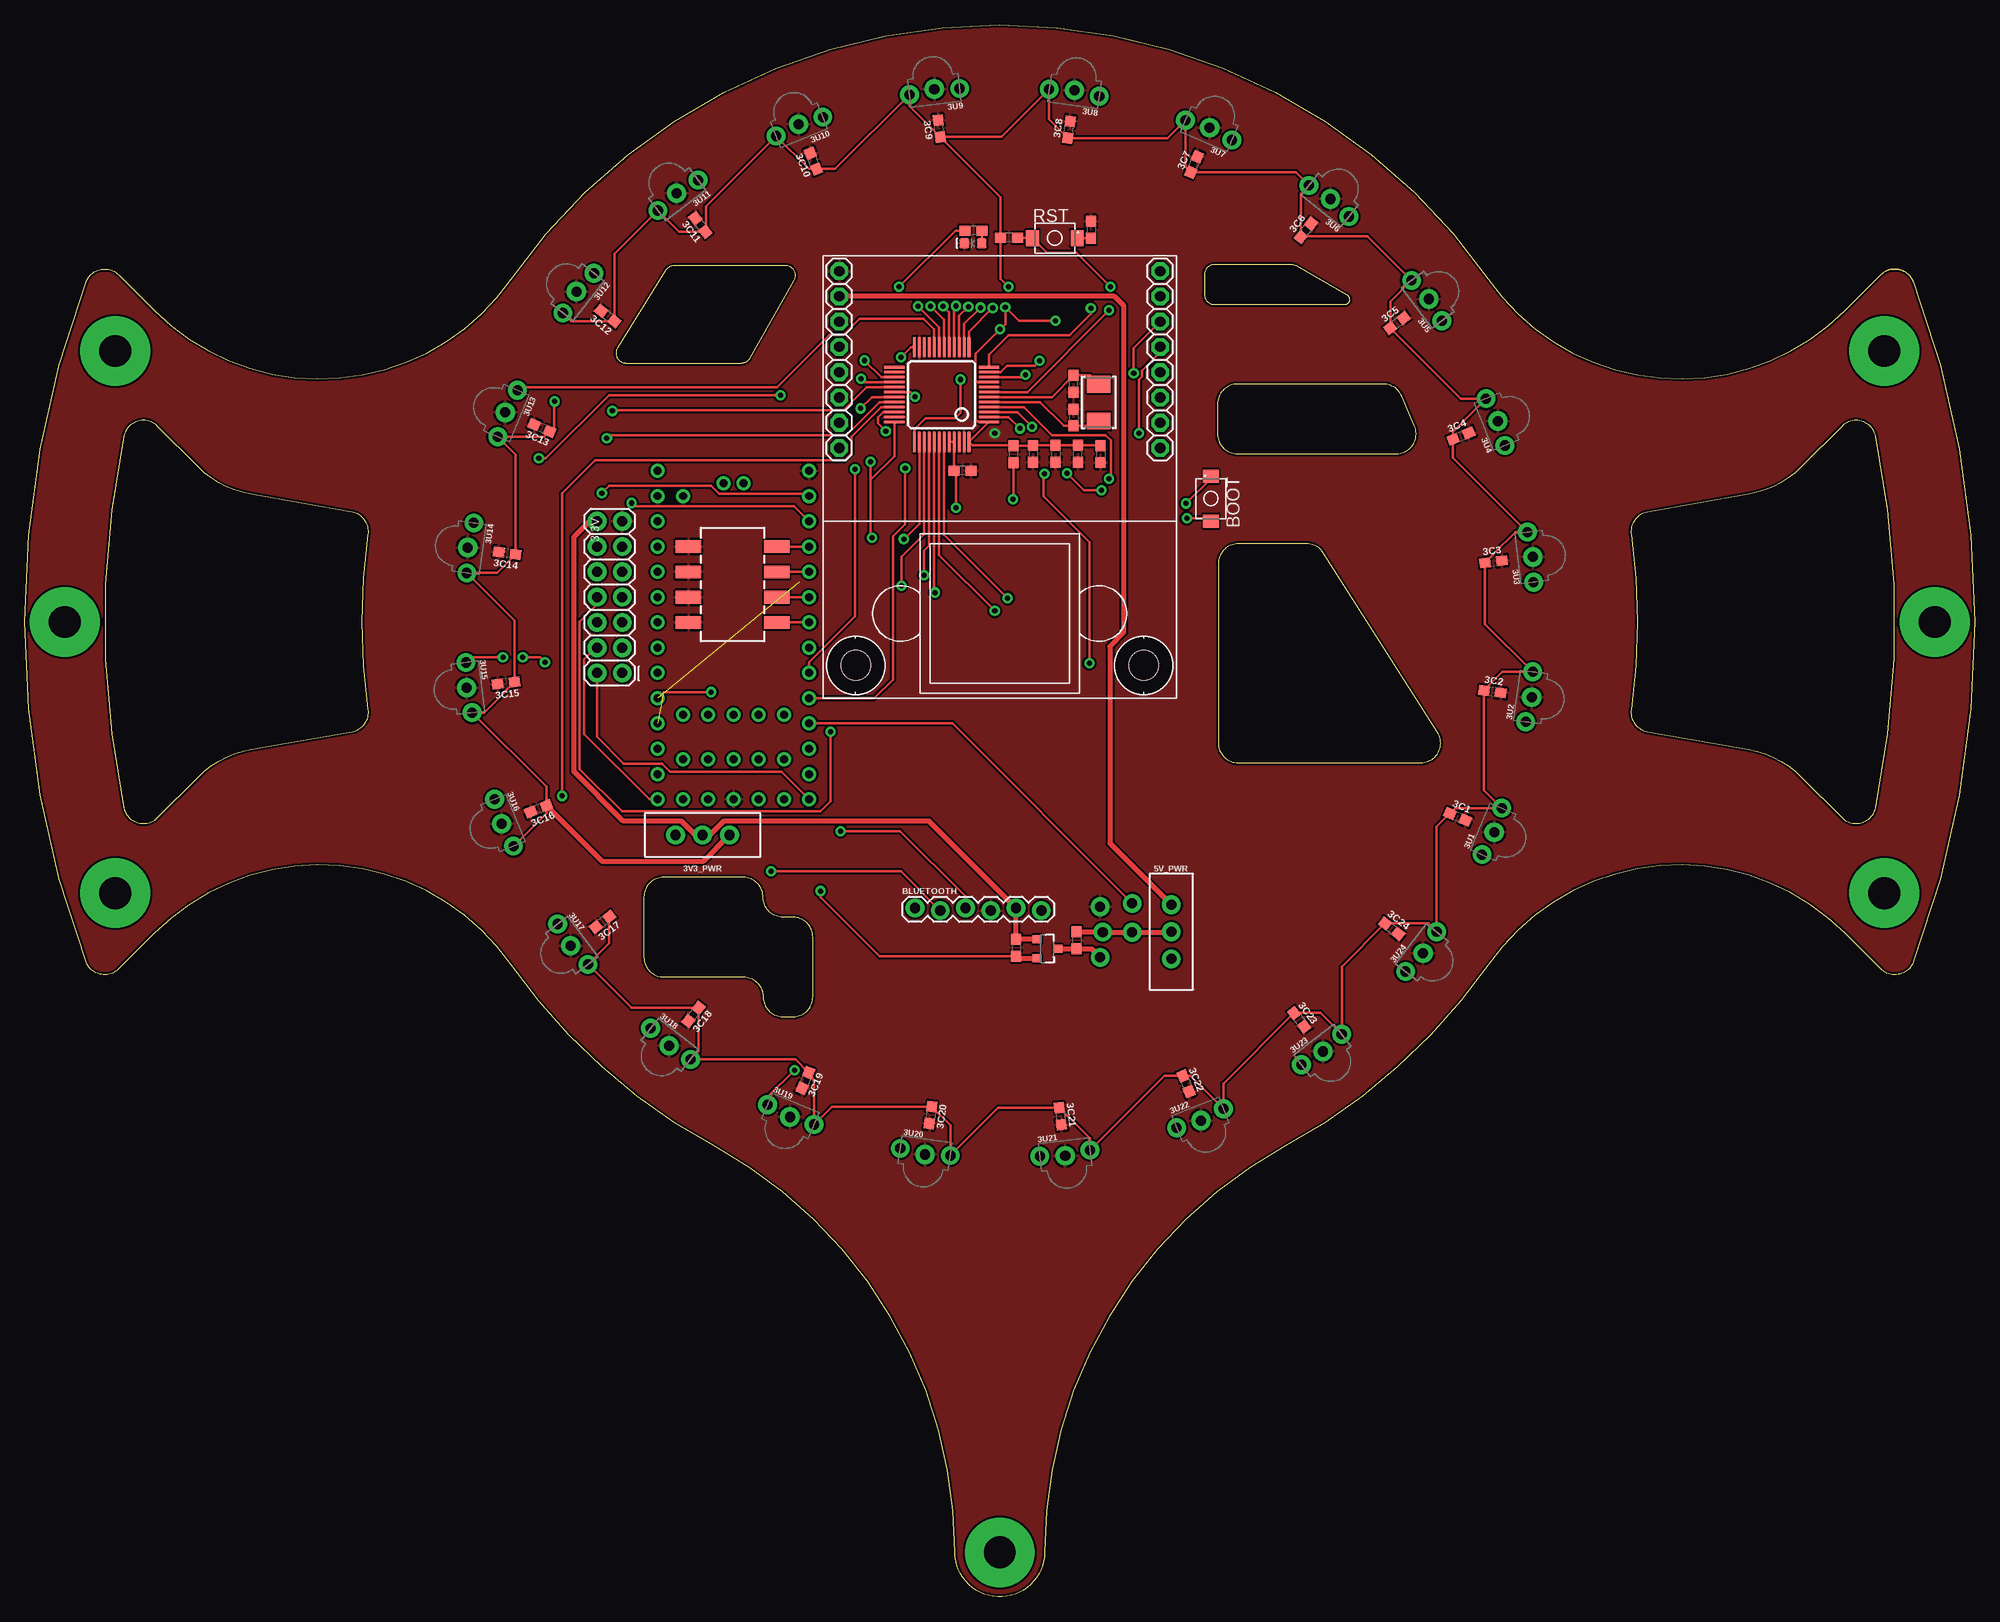
[diagram p5: board, top side]
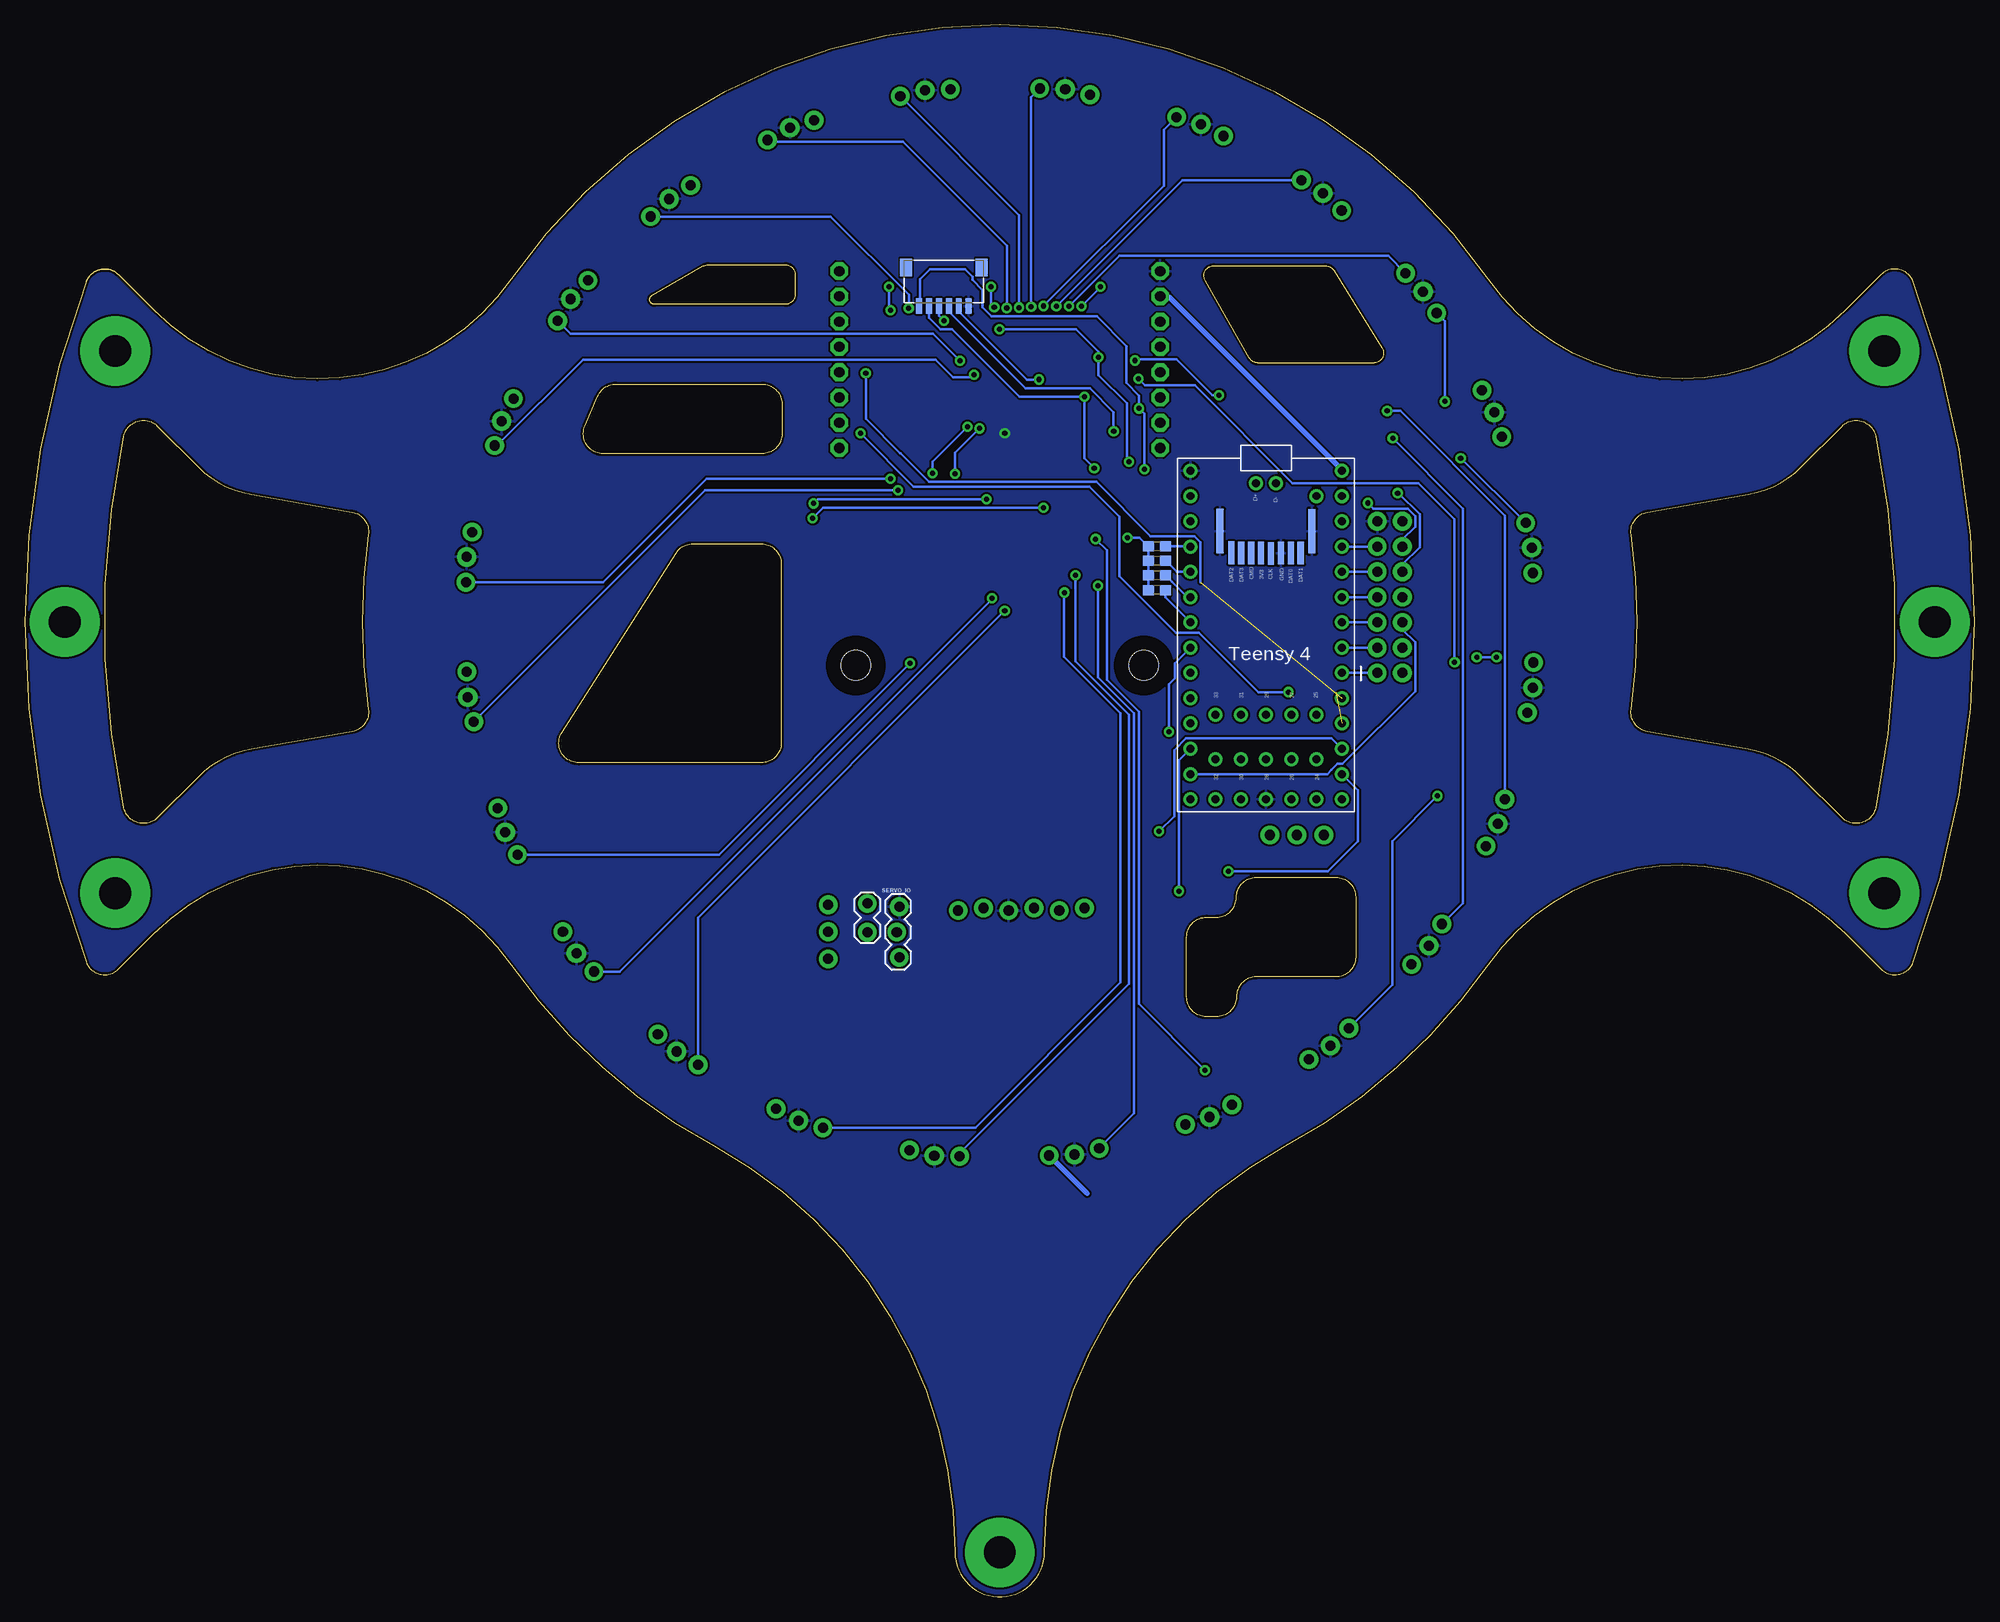
[diagram p6: board, bottom side, seen from below]

Size 196 x 157.98 mm. Coordinates in mm from the lower left corner, seen from the top.
Outline: 147.13,132.41 arc100 183,129.28
Outline: 189.85,132.14 arc115 186.57,132.85
Outline: 189.85,63.82 arc-115 186.57,63.1
Outline: 183,129.28 arc-100 147.13,132.41 arc110 48.87,132.41 arc-100 13.01,129.28 9.44,132.85 arc115 6.15,132.14 arc41 6.15,63.82 arc115 9.44,63.1 13.01,66.67 arc-100 48.87,63.54 arc26 69.27,45.3 arc-61 93.5,4.48 arc180 102.5,4.48 arc-61 126.73,45.3 arc26 147.13,63.54 arc-100 183,66.67 186.57,63.1
Outline: 183,129.28 186.57,132.85
Outline: 186.57,132.85 arc-115 189.85,132.14
Outline: 189.85,132.14 arc-41 189.85,63.82
Outline: 189.85,63.82 arc-115 186.57,63.1
Outline: 186.04,79.31 arc24 186.04,116.65 arc123 182.67,117.65 178.6,113.57 arc-35 173.26,110.8 163.1,109 arc88 161.47,106.76 arc-16 161.47,89.2 arc88 163.1,86.95 173.26,85.16 arc-35 178.6,82.38 182.67,78.31 arc123 186.04,79.31
Outline: 121.89,114.88 137.86,114.88 arc113 139.7,117.67 138.41,120.67 arc67 136.58,121.88 121.89,121.88 arc90 119.89,119.88 119.89,116.88 arc90 121.89,114.88
Outline: 119.97,103.82 119.97,85.82 arc90 121.97,83.82 140.32,83.82 arc122 142.01,86.89 130.56,104.89 arc58 128.87,105.82 121.97,105.82 arc90 119.97,103.82
Outline: 118.57,132.88 118.57,130.88 arc90 119.57,129.88 132.69,129.88 arc150 132.94,130.81 127.8,133.75 arc30 127.31,133.88 119.57,133.88 arc90 118.57,132.88
Outline: 72.21,72.3 64.21,72.3 arc90 62.21,70.3 62.21,64.3 arc90 64.21,62.3 72.21,62.3 arc-90 74.21,60.3 arc90 76.21,58.3 77.21,58.3 arc90 79.21,60.3 79.21,66.3 arc90 77.21,68.3 76.21,68.3 arc-90 74.21,70.3 arc90 72.21,72.3
Outline: 64.43,133.3 59.56,125.52 arc122 60.41,123.99 72.03,123.99 arc60 72.9,124.5 77.34,132.28 arc120 76.47,133.77 65.27,133.77 arc58 64.43,133.3
Outline: 13.33,117.65 arc123 9.96,116.65 arc24 9.96,79.31 arc123 13.33,78.31 17.4,82.38 arc-35 22.74,85.16 32.9,86.95 arc88 34.53,89.2 arc-16 34.53,106.76 arc88 32.9,109 22.74,110.8 arc-35 17.4,113.57 13.33,117.65
Copper layers (1*16): Top 0.035mm / dielectric 1.5mm / Bottom 0.035mm
Design rules "Sparkfun": minimum track width 8mil, minimum drill 20mil, track to track 8mil, track to pad 8mil, pad to pad 8mil, via to via 8mil, smd to smd 8mil, copper to edge 10mil, drill to drill 8mil, minimum pad ring 12mil, minimum via ring 10mil, stop-mask expansion 4mil, vias tented up to drill 25mil, thermal gap 10mil

### Footprints (pad centres in the part's own frame; a part is rotated, then mirrored left to right if it is on the bottom)
C0603 = smd 1.1 x 1: 1 -0.85,0; 2 0.85,0
TSSP58038 = drill 1.016 pad 1.93: GND 0,0 | drill 1.016 pad 1.88: OUT -0.254,-2.54; VS -0.254,2.54
SWITCH_SPDT_PTH_11.6X4.0MM_LOCK = drill 1.016 pad 1.88: 1 0,2.718; 2 0,0; 3 0,-2.718
HC-05 = drill 1.016 pad 1.88: 1 0,0; 2 2.54,-0.254; 3 5.08,0; 4 7.62,-0.254; 5 10.16,0; 6 12.7,-0.254
MOMENTARY_SWITCH_4X3 = smd 1.3 x 1.6: P$1 -2.25,0; P$2 2.25,0
LED-0603 = smd 1 x 1: A -0.877,0; C 0.877,0
1X02_LOCK = drill 1.016 pad 1.88: 1 -0.178,0; 2 2.718,0
SOT23-3 = smd 0.8 x 0.9: 1 -0.95,-1; 2 0.95,-1; 3 0,1.1
R0603 = smd 1.1 x 1: 1 -0.85,0; 2 0.85,0
DIPSWITCH-04-SMD = smd 1.27 x 2.54: 1 -3.81,4.445; 2 -1.27,4.445; 3 1.27,4.445; 4 3.81,4.445; 5 3.81,-4.445; 6 1.27,-4.445; 7 -1.27,-4.445; 8 -3.81,-4.445
1X03_LOCK = drill 1.016 pad 1.88: 1 0,0.127; 2 2.54,-0.127; 3 5.08,0.127
LQFP48 = smd 0.254 x 2.032: 1 -2.75,-4.758; 2 -2.25,-4.758; 3 -1.75,-4.758; 4 -1.25,-4.758; 5 -0.75,-4.758; 6 -0.25,-4.758; 7 0.25,-4.758; 8 0.75,-4.758; 9 1.25,-4.758; 10 1.75,-4.758; 11 2.25,-4.758; 12 2.75,-4.758; 25 2.75,4.758; 26 2.25,4.758; 27 1.75,4.758; 28 1.25,4.758; 29 0.75,4.758; 30 0.25,4.758; 31 -0.25,4.758; 32 -0.75,4.758; 33 -1.25,4.758; 34 -1.75,4.758; 35 -2.25,4.758; 36 -2.75,4.758 | smd 2.032 x 0.254: 13 4.758,-2.75; 14 4.758,-2.25; 15 4.758,-1.75; 16 4.758,-1.25; 17 4.758,-0.75; 18 4.758,-0.25; 19 4.758,0.25; 20 4.758,0.75; 21 4.758,1.25; 22 4.758,1.75; 23 4.758,2.25; 24 4.758,2.75; 37 -4.758,2.75; 38 -4.758,2.25; 39 -4.758,1.75; 40 -4.758,1.25; 41 -4.758,0.75; 42 -4.758,0.25; 43 -4.758,-0.25; 44 -4.758,-0.75; 45 -4.758,-1.25; 46 -4.758,-1.75; 47 -4.758,-2.25; 48 -4.758,-2.75
TEENSY-4.0-FULL-BREAKOUT-PINS = drill 0.8: 3.3V@1 8.89,10.16; 3.3V@2 -1.27,-17.78; AGND 8.89,12.7; D0 -6.35,12.7; D1 -6.35,10.16; D2 -6.35,7.62; D3 -6.35,5.08; D4 -6.35,2.54; D5 -6.35,0; D6 -6.35,-2.54; D7 -6.35,-5.08; D8 -6.35,-7.62; D9 -6.35,-10.16; D10 -6.35,-12.7; D11 -6.35,-15.24; D12 -6.35,-17.78; D13/LED 8.89,-17.78; D14/A0 8.89,-15.24; D15/A1 8.89,-12.7; D16/A2 8.89,-10.16; D17/A3 8.89,-7.62; D18/A4 8.89,-5.08; D19/A5 8.89,-2.54; D20/A6 8.89,0; D21/A7 8.89,2.54; D22/A8 8.89,5.08; D23/A9 8.89,7.62; D24 6.35,-13.773; D25 6.35,-9.271; D26 3.81,-13.773; D27 3.81,-9.271; D28 1.27,-13.773; D29 1.27,-9.271; D30 -1.27,-13.773; D31 -1.27,-9.271; D32 -3.81,-13.773; D33 -3.81,-9.271; GND@1 -6.35,15.24; GND@2 1.27,-17.78; ON/OFF 6.35,-17.78; PROGRAM 3.81,-17.78; USB-D+1 0.254,13.97; USB-D- 2.286,13.97; VBAT -3.81,-17.78; VIN 8.89,15.24; VUSB 6.35,12.7 | smd 0.635 x 2.286: 3V3 0.762,6.965; D34/DAT1 4.762,6.965; D35/DAT0 3.762,6.965; D36/CLK 1.762,6.935; D37/CMD -0.238,6.965; D38/DAT3 -1.238,6.965; D39/DAT2 -2.207,7.005; GND 2.762,6.965 | smd 0.711 x 4.445: P$11 5.889,9.163; P$12 -3.365,9.176
OPENMV3 = drill 1.016 pad 1.778 octagon: 11 1.651,19.304; 12 1.651,16.764; 13 1.651,14.224; 14 1.651,11.684; 15 1.651,9.144; 16 1.651,6.604; 17 1.651,4.064; 18 1.651,1.524; 21 33.909,19.304; 22 33.909,16.764; 23 33.909,14.224; 24 33.909,11.684; 25 33.909,9.144; 26 33.909,6.604; 27 33.909,4.064; 28 33.909,1.524 | hole 3: 3.302,41.148; 32.258,41.148
2X7 = drill 1.016 pad 1.88: 1 0,0; 2 0,2.54; 3 2.54,0; 4 2.54,2.54; 5 5.08,0; 6 5.08,2.54; 7 7.62,0; 8 7.62,2.54; 9 10.16,0; 10 10.16,2.54; 11 12.7,0; 12 12.7,2.54; 13 15.24,0; 14 15.24,2.54
SM06B-SRSS-TB = smd 0.6 x 1.55: 1 2.5,0; 2 1.5,0; 3 0.5,0; 4 -0.5,0; 5 -1.5,0; 6 -2.5,0 | smd 1.2 x 1.8: M1 3.8,3.875; M2 -3.8,3.875
CRYSTAL-SMD-5X3.2-2PAD = smd 1.7 x 2.4: P$1 1.85,0; P$2 -1.85,0

### Placement (x,y rotation side)
3C1  144.03,78.39 337 top
3C2  147.51,90.97 352 top
3C3  147.63,104.02 7 top
3C4  144.36,116.66 22 top
3C5  137.93,128.02 37 top
3C6  128.78,137.33 52 top
3C7  117.54,143.95 67 top
3C8  104.96,147.44 82 top
3C9  91.91,147.56 97 top
3C10  79.27,144.29 112 top
3C11  67.91,137.86 127 top
3C12  58.6,128.71 142 top
3C13  51.97,117.47 157 top
3C14  48.49,104.89 172 top
3C15  48.37,91.84 187 top
3C16  51.64,79.2 202 top
3C17  58.07,67.84 217 top
3C18  67.22,58.53 232 top
3C19  78.46,51.9 247 top
3C20  91.04,48.42 262 top
3C21  104.09,48.3 277 top
3C22  116.73,51.57 292 top
3C23  128.09,58 307 top
3C24  137.4,67.15 322 top
3U1  147.71,76.83 337 top
3U2  151.47,90.41 352 top
3U3  151.6,104.51 7 top
3U4  148.07,118.16 22 top
3U5  141.13,130.43 37 top
3U6  131.25,140.48 52 top
3U7  119.1,147.64 67 top
3U8  105.52,151.4 82 top
3U9  91.42,151.53 97 top
3U10  77.77,148 112 top
3U11  65.5,141.05 127 top
3U12  55.45,131.17 142 top
3U13  48.29,119.03 157 top
3U14  44.53,105.44 172 top
3U15  44.4,91.35 187 top
3U16  47.93,77.7 202 top
3U17  54.87,65.43 217 top
3U18  64.75,55.38 232 top
3U19  76.9,48.22 247 top
3U20  90.48,44.45 262 top
3U21  104.58,44.33 277 top
3U22  118.23,47.86 292 top
3U23  130.5,54.8 307 top
3U24  140.55,64.68 322 top
3V3_PWR  68.13,76.56 270 top
5V_PWR  115.25,66.83 0 top
BLUETOOTH  89.48,69.22 0 top
BOOT  119.23,110.36 270 top
C1  101.35,114.86 270 top
C2  103.61,114.87 270 top
C3  108.13,114.85 270 top
C5  105.86,114.87 90 top
C6  105.43,118.52 270 top
C7  105.42,121.9 90 top
D1  95.32,136.02 180 top
J1  111.31,69.51 270 bottom
Q2  102.74,65.12 270 top
R1  98.93,136.6 180 top
R2  107.17,137.37 270 top
R3  99.39,114.81 90 top
R4  94.26,113.19 180 top
R5  95.35,137.31 180 top
R6  82.21,105.56 180 bottom
R7  82.21,104.11 180 bottom
R8  82.21,102.65 180 bottom
R9  82.21,101.17 180 bottom
R12  105.73,65.97 270 top
R13  99.64,65.23 270 top
RST  103.54,136.55 180 top
S1  71.14,101.73 270 top
SERVO_IO  108.22,69.34 270 bottom
STM32_IR  92.16,120.82 90 top
TEENSY4  72.5,97.93 0 bottom
U$8  115.78,134.76 180 top
U$14  60.05,92.85 90 top
X1  103.62,129.72 0 bottom
Y1  107.95,120.02 90 top

### Tracks (layer width: path | path; a pad name or v marks a point on that pad's centre or on a via)
3.3V
  Top 0.508: U$14.14 56.76,108.09 55.2,106.53 55.2,82.93 60.16,77.96 65.99,77.96 67.39,76.56 3V3_PWR.2 68.86,76.56 70.26,77.96 90.9,77.96 BLUETOOTH.5 R13.1 99.65,66.07 Q2.1
3V3_SWITCH  (via drill 0.51)
  Top 0.254: C3.1 108.11,115.72 C5.2 C2.1 103.6,115.71 C1.1 101.31,115.66 R3.2 99.34,115.72 95.25,115.72 STM32_IR.48 STM32_IR.1 96.9,118.08 95.79,118.08 95.57,118.3 95.57,122.3 | 95.57,122.3 95.81,122.07 STM32_IR.9 | R1.2 | R1.2 98.08,132.46 v98.88,131.66 | 95.57,122.3 95.57,124.91 v98.04,127.38 98.56,127.9 v98.56,129.6 99.92,128.24 v103.62,128.24 | v53.24,120.13 53.22,120.11 53.22,117.59 3C13.1 52.22,116.59 3U13.VS 49.33,114.8 3C14.1 47.45,102.89 3U14.VS 49.22,98.1 3C15.1 48.48,91.2 48.31,90.99 46.18,88.86 3U15.VS 52.43,81.39 3C16.1 52.43,78.75 3U16.VS | 3U12.VS 54.91,128.19 57.92,128.19 57.96,128.16 58.22,128.19 3C12.1 59.27,134.95 3U11.VS 65.77,137.18 3C11.1 68.48,137.24 68.48,139.77 3U10.VS 78.82,143.5 3C10.1 81.46,143.5 3U9.VS 88.93,149.79 91.06,147.67 91.06,147.62 91.27,147.45 3C9.1 | 3C17.1 58.75,65.7 3U17.VS | 3U17.VS | 3U17.VS 60.98,59.2 3C18.1 67.74,58.15 67.77,57.89 67.74,57.85 67.74,54.84 3U18.VS 77.47,54.01 3C19.1 79.34,51.88 3U19.VS 81.13,49.26 3C20.1 93.04,47.38 3U20.VS 97.83,49.14 3C21.1 104.73,48.4 104.94,48.24 104.95,48.19 107.07,46.06 3U21.VS 114.54,52.36 3C22.1 117.18,52.36 3U22.VS 120.49,51.59 3C23.1 130.23,58.68 3U23.VS 132.37,63.31 3C24.1 137.78,67.67 138.04,67.7 138.08,67.67 141.09,67.67 3U24.VS 141.92,77.4 3C1.1 143.79,79.27 3U1.VS 146.67,81.06 3C2.1 148.55,92.96 3U2.VS 146.78,97.76 3C3.1 147.52,104.66 147.69,104.87 149.82,107 3U3.VS 143.57,114.46 3C4.1 143.57,117.11 3U4.VS 144.34,120.42 3C5.1 137.25,130.16 3U5.VS 134.97,136.73 128.33,136.73 3C6.1 128.26,137.71 128.23,137.97 128.26,138.01 128.26,141.02 3U6.VS 127.76,143.17 3C7.1 116.66,143.71 3U7.VS 114.87,146.6 3C8.1 102.97,148.48 3U8.VS 98.17,146.71 3C9.1
  Top 0.254: R1.2 98.08,140.64 3C9.1 | STM32_IR.36 87.4,114.64 85,112.24 | 85,112.24 85,106.57 v85.14,106.43 | STM32_IR.24 89.06,125.58 v88.06,124.57 | v85,114.07 85,112.24
  Top 0.508: 3C16.1 58.02,73.93 68.22,73.93 3V3_PWR.1
  Bottom 0.254: v53.24,120.13 53.24,128.17 3U12.VS | v98.56,129.6 98.88,129.92 v98.88,131.66 | X1.4 104.12,128.74 v103.62,128.24 | R9.2 R8.2 R7.2 R6.2 83.11,105.56 83.97,106.43 v85.14,106.43 | v98.04,127.38 90.31,127.38 88.06,125.13 v88.06,124.57 88.06,122.76 85.23,119.93 85.23,114.3 v85,114.07
  Bottom 0.508: 89.22,40.54 3U20.VS
5V
  Top 0.508: R12.1 108.33,66.82 SERVO_IO.2 111.3,66.8 J1.2 115.22,66.79 5V_PWR.2
5V_SWITCH
  Top 0.508: U$8.27 109.55,130.69 110.46,129.78 110.46,96.92 109.06,95.52 109.06,75.74 5V_PWR.1
  Bottom 0.508: U$8.27 81.06,130.69 63.61,113.24 TEENSY4.VIN
BATT_LVL
  Bottom 0.254: U$14.11 TEENSY4.D23/A9 | TEENSY4.D23/A9
BL_DIR
  Bottom 0.254: U$14.6 57.51,97.19 56.24,95.92 56.24,91.02 63.54,83.73 64.04,83.73 64.65,83.12 65.08,82.69 TEENSY4.D11
BL_PWM
  Bottom 0.254: U$14.5 TEENSY4.D20/A6 | TEENSY4.D20/A6
BOOT0  (via drill 0.51)
  Top 0.254: STM32_IR.44 STM32_IR.45 93.41,113.26 93.45,113.22 R4.2 93.59,113.01 v93.59,109.44 | BOOT.P$2 118.96,108.39 v116.8,108.39
  Bottom 0.254: v116.8,108.39 115.75,109.44 v93.59,109.44
BR_DIR  (via drill 0.51)
  Top 0.254: U$14.8 57.51,99.73 55.78,98 55.78,83.17 60.02,78.93 80,78.93 81,79.93 v81,86.93
  Bottom 0.254: TEENSY4.D6 80.4,93.84 80.4,92.32 81,91.71 v81,86.93
BR_PWM
  Bottom 0.254: U$14.7 TEENSY4.D21/A7 | TEENSY4.D21/A7
DIP1
  Top 0.254: S1.1 TEENSY4.D2
  Bottom 0.254: R6.1 78.87,105.56 TEENSY4.D2
DIP2
  Top 0.254: S1.2 TEENSY4.D3
  Bottom 0.254: R7.1 81.3,104.11 80.2,103.01 TEENSY4.D3
DIP3
  Top 0.254: S1.3 TEENSY4.D4
  Bottom 0.254: R8.1 80.71,102 80.67,102 79.14,100.47 TEENSY4.D4
DIP4
  Top 0.254: S1.4 TEENSY4.D5
  Bottom 0.254: R9.1 81.36,100.44 TEENSY4.D5
ESC_LV
  Top 0.254: J1.1 93.23,87.77 TEENSY4.D9
FL_DIR
  Top 0.254: TEENSY4.D12 76.07,82.93 64.84,82.93 64.04,83.73 60.2,83.73 57.51,86.41 U$14.2
  Bottom 0.254: U$14.2 57.51,92.4
FL_PWM
  Bottom 0.254: U$14.1 TEENSY4.D18/A4 | TEENSY4.D18/A4
FR_DIR
  Top 0.254: U$14.4 57.41,95.39 56.24,94.23 56.24,86.69 62.78,80.15 TEENSY4.D13/LED
FR_PWM
  Bottom 0.254: U$14.3 TEENSY4.D19/A5 | TEENSY4.D19/A5
GND  (via drill 0.51)
  other vias: 97.5,116.93
  pour Top: -35.35,203.34 -35.35,-1.31 237.7,-1.31 237.7,203.34
  pour Bottom: -35.35,203.34 -35.35,-1.31 237.7,-1.31 237.7,203.34
IR1  (via drill 0.51)
  Top 0.254: STM32_IR.2 98.88,118.57 v100.03,117.42 | v102.49,112.88 102.4,112.79 102.4,110.6 107,106 v107,93.82
  Bottom 0.254: v100.03,117.42 102.49,114.95 v102.49,112.88 | 3U1.OUT 126.23,74.59 v107,93.82
IR2  (via drill 0.51)
  Top 0.254: STM32_IR.3 99.76,119.07 v101.25,117.58 | v104.76,112.9 106.46,111.2 v108.23,111.2
  Bottom 0.254: v101.25,117.58 104.76,114.07 v104.76,112.9 | 3U2.OUT 127.6,111.2 v108.23,111.2
IR3  (via drill 0.51)
  Top 0.254: STM32_IR.4 100.45,119.57 103.27,116.75 108.63,116.75 109.16,116.22 109.16,112.53 v109,112.37
  Bottom 0.254: 3U3.OUT 137.89,101.96 127.48,112.37 v109,112.37
IR4  (via drill 0.51)
  Top 0.254: STM32_IR.10 100.33,122.57 v100.57,122.81
  Bottom 0.254: 3U4.OUT 148.53,115.71 139.9,124.34 104.48,124.34 102.72,122.58 100.8,122.58 v100.57,122.81
IR5  (via drill 0.51)
  Top 0.254: v102.01,124.22 101.52,123.73 98.72,123.73 98.06,123.07 STM32_IR.11
  Bottom 0.254: 3U5.OUT 141.14,126.93 104.72,126.93 v102.01,124.22
IR6  (via drill 0.51)
  Top 0.254: STM32_IR.12 96.92,124.82 98.89,126.8 104.99,126.8 107.15,128.95 v107.15,129.49
  Bottom 0.254: v107.15,129.49 107.12,129.52 107.12,130.84 115,138.72 3U6.OUT
IR7  (via drill 0.51)
  Top 0.254: STM32_IR.13 94.91,127.14 v97.3,129.53
  Bottom 0.254: 3U7.OUT 121.16,146.23 107.73,146.23 97.3,135.79 v97.3,129.53
IR8  (via drill 0.51)
  Top 0.254: STM32_IR.14 94.41,127.92 v96.06,129.57
  Bottom 0.254: 3U8.OUT 96.06,138.86 v96.06,129.57
IR9  (via drill 0.51)
  Top 0.254: STM32_IR.15 93.91,128.73 v94.84,129.65
  Bottom 0.254: v94.84,129.65 94.84,150.72 3U9.OUT
IR10  (via drill 0.51)
  Top 0.254: STM32_IR.16 93.41,129.54 v93.59,129.73
  Bottom 0.254: v93.59,129.73 81.49,141.83 81.49,147.44 3U10.OUT
IR11  (via drill 0.51)
  Top 0.254: STM32_IR.17 92.92,129.08 v92.32,129.68
  Bottom 0.254: v92.32,129.68 79.62,142.38 3U11.OUT
IR12  (via drill 0.51)
  Top 0.254: STM32_IR.18 92.41,128.33 v91.04,129.7
  Bottom 0.254: 3U12.OUT 58.95,134.76 80.96,134.76 80.99,134.76 85.98,134.76 v91.04,129.7
IR13
  Top 0.254: 3U13.OUT 49.82,121.57 75.6,121.57 80.87,126.84 82.32,126.84 83.93,128.45 90.35,128.45 91.41,127.39 STM32_IR.20
IR14  (via drill 0.51)
  Top 0.254: STM32_IR.27 86.1,122.57 v84.42,124.25 | v75.95,120.77 58.71,120.77 52.37,114.43 v51.67,114.43
  Bottom 0.254: v75.95,120.77 76.63,120.77 80.22,124.36 84.31,124.36 v84.42,124.25 | 3U14.OUT 51.64,114.43 v51.67,114.43
IR15  (via drill 0.51)
  Top 0.254: STM32_IR.28 84.4,122.07 v84.05,122.41 | v52.28,93.93 51.78,94.43 v50.06,94.43 | v48.06,94.43 44.87,94.43 3U15.OUT
  Bottom 0.254: v52.28,93.93 v52.27,93.93 52.27,108.27 55.93,111.93 68.57,111.93 78.4,121.76 83.4,121.76 v84.05,122.41 | v50.06,94.43 v48.06,94.43
IR16  (via drill 0.51)
  Top 0.254: v59.05,119.18 59.13,119.25 82.31,119.25 84.63,121.57 STM32_IR.29
  Bottom 0.254: v59.05,119.18 57.75,119.18 47.22,108.64 3U16.OUT
IR17  (via drill 0.51)
  Top 0.254: STM32_IR.32 85.89,120.07 82.57,116.75 58.82,116.75 v58.5,116.43
  Bottom 0.254: 3U17.OUT 51.44,69.72 51.44,108.43 51.44,109.37 v58.5,116.43
IR18  (via drill 0.51)
  Top 0.254: STM32_IR.33 86.06,119.57 83.09,116.6 83.09,114.95 82.38,114.23 57.31,114.23 54,110.93 v54,80.48
  Bottom 0.254: v54,80.48 58.54,75.95 58.54,61.51 3U18.OUT
IR19  (via drill 0.51)
  Top 0.254: 3U19.OUT 74.66,50.24 v77.36,52.94 | STM32_IR.38 89.91,107.85 v88.36,106.3
  Bottom 0.254: v88.36,106.3 87.25,105.19 87.25,92.17 84,88.93 84,59.58 v77.36,52.94
IR20  (via drill 0.51)
  Top 0.254: STM32_IR.39 90.41,106.79 88.14,104.52 v88.14,101.61
  Bottom 0.254: 3U20.OUT 88.01,45.1 84.52,48.59 84.52,88.8 88.14,92.42 v88.14,101.61
IR21  (via drill 0.51)
  Top 0.254: STM32_IR.40 90.91,105.61 90.41,105.1 v90.41,102.67
  Bottom 0.254: v90.41,102.67 90.41,94.04 85,88.63 85,61.61 102.03,44.58 3U21.OUT
IR22  (via drill 0.51)
  Top 0.254: v91.5,100.93 91.41,101.02 STM32_IR.41
  Bottom 0.254: v91.5,100.93 91.57,100.86 91.57,94.49 85.85,88.78 85.85,61.75 100.45,47.14 3U22.OUT
IR23  (via drill 0.51)
  Top 0.254: STM32_IR.42 91.91,104.67 v97.5,99.08
  Bottom 0.254: v97.5,99.08 128.32,68.26 3U23.OUT
IR24  (via drill 0.51)
  Top 0.254: v98.8,100.37 92.41,106.76 STM32_IR.43
  Bottom 0.254: 3U24.OUT 136.22,62.84 98.8,100.27 v98.8,100.37
LIGHT_INT
  Bottom 0.254: U$14.9 TEENSY4.D22/A8 | TEENSY4.D22/A8
N$3  (via drill 3.2 pad 7)
  other vias: 186.92,70.72
N$4  (via drill 3.2 pad 7)
  other vias: 192,97.96
N$5  (via drill 3.2 pad 7)
  other vias: 186.92,125.21
N$7  (via drill 3.2 pad 7)
  other vias: 9.08,125.21
N$8  (via drill 3.2 pad 7)
  other vias: 4,97.96
N$9  (via drill 3.2 pad 7)
  other vias: 9.08,70.72
N$10  (via drill 3.2 pad 7)
  other vias: 98,4.46
N$70
  Top 0.254: RST.P$1 107.15,136.55 R2.2
N$72  (via drill 0.51)
  Top 0.254: R3.1 99.39,110.37 v99.34,110.31 | v116.7,109.88 116.73,109.88 119.23,112.38 BOOT.P$1
  Bottom 0.254: v99.34,110.31 116.27,110.31 v116.7,109.88
N$73  (via drill 0.51)
  Top 0.254: v89.79,129.71 91.91,127.59 STM32_IR.19 | v87.89,131.66 93.54,137.31 R5.2
  Bottom 0.254: v87.89,131.66 87.89,131.61 v89.79,129.71
N$74
  Top 0.254: R5.1 D1.A
OSC_IN
  Top 0.254: STM32_IR.5 102.07,120.07 104.47,117.67 C6.2 107.45,117.67 Y1.P$2
OSC_OUT
  Top 0.254: STM32_IR.6 103.23,120.57 C7.2 107.07,122.75 Y1.P$1
RESET  (via drill 0.51)
  Top 0.254: STM32_IR.7 100.78,121.07 v109,129.29 | v109.13,131.66 105.71,135.08 102.76,135.08 RST.P$2 101.24,136.6 R1.1
  Bottom 0.254: v109.13,131.66 109.13,129.42 v109,129.29
RX1_ST2  (via drill 0.51)
  Top 0.254: v84,119.43 85.14,120.57 STM32_IR.31 | TEENSY4.D7 78.85,93.92 83.46,98.53 v83.46,113.31
  Bottom 0.254: v83.46,113.31 83.46,118.89 v84,119.43 84,120.73 85.26,121.99 85.26,125.69 88.25,128.68 98.82,128.68 99.72,129.57 99.72,131.31 100.75,132.35 100.75,132.68 101.5,133.43 105,133.43 106,132.43 106,129.85 X1.6
RX3_ST1  (via drill 0.51)
  Top 0.254: v58,110.93 58.74,111.67 68.98,111.67 69.79,110.86 78.62,110.86 TEENSY4.D0
  Bottom 0.254: U$14.10 57.51,103.75 55.78,105.48 55.78,108.81 57.91,110.93 v58,110.93
RX_BT  (via drill 0.51)
  Top 0.254: BLUETOOTH.2 88.06,72.93 v75,72.93
  Bottom 0.254: TEENSY4.D14/A0 62,81.08 62,75.93 65,72.93 v75,72.93
RX_CAM  (via drill 0.51)  (1 unrouted)
  Top 0.254: U$8.16 111.46,125.49 v111.46,122.97
  Bottom 0.254: 77.81,101.97 77.81,105.98 78.42,106.59 82.85,106.59 88.3,112.04 105.09,112.04 107.98,114.93 108,114.93 111.46,118.39 v111.46,122.97
SERVO_HV
  Top 0.508: Q2.3 R12.2 107.23,65.12 SERVO_IO.3
SERVO_LV  (via drill 0.51)
  Top 0.254: R13.2 85.93,64.38 80,70.32 v80,70.93
  Top 0.508: R13.2 99.85,64.17 Q2.2
  Bottom 0.254: TEENSY4.D10 80,84.08 v80,70.93
SWCLK  (via drill 0.51)
  Top 0.254: STM32_IR.37 89.41,117.31 90.52,118.43 93.5,118.43 94.06,118.99 v94.06,122.34
  Bottom 0.254: X1.2 102.13,129.71 102.13,129.19 95.28,122.34 v94.06,122.34
SWDIO  (via drill 0.51)
  Top 0.254: STM32_IR.34 87.39,119.06 86.28,119.06 85.75,118.53 85.75,117.93 v86.55,117.13
  Bottom 0.254: X1.3 103.13,129.18 95.41,121.46 88.94,121.46 86.55,119.07 v86.55,117.13
TX1_ST2  (via drill 0.51)
  Top 0.254: v88.5,113.43 88.5,107.81 87.26,106.57 87.26,92.19 85.38,90.31 TEENSY4.D8 | v89.49,120.62 89.05,121.07 STM32_IR.30
  Bottom 0.254: v88.5,113.43 89.49,114.42 v89.49,120.62 96.02,120.62 102.79,127.4 103.97,127.4 105.1,128.52 105.1,129.7 X1.5
TX3_ST1  (via drill 0.51)
  Top 0.254: v61,109.93 61.34,109.59 77.35,109.59 TEENSY4.D1
  Bottom 0.254: v61,109.93 60.43,109.36 56.99,109.36 56.24,108.62 56.24,107.56 57.51,106.29 U$14.12
TX_BT  (via drill 0.51)
  Top 0.254: BLUETOOTH.3 94.56,70.39 88,76.95 82.02,76.95 v82,76.93
  Bottom 0.254: v82,76.93 80.46,78.47 80.46,85.09 79.28,86.27 64.65,86.27 TEENSY4.D15/A1
TX_CAM  (via drill 0.51)  (1 unrouted)
  Top 0.254: U$8.15 114.13,125.06 112.31,123.23 112.31,122.63 112,122.32 v112,116.93 | 64.23,90.93 v69,90.93
  Bottom 0.254: v112,116.93 106.65,111.58 89,111.58 85.98,108.56 85.98,102.57 80.3,96.89 77.96,96.89 72,90.93 v69,90.93

### Text on the board
tNames: 3.3V